# Altium project Topping_L50.PrjPcb
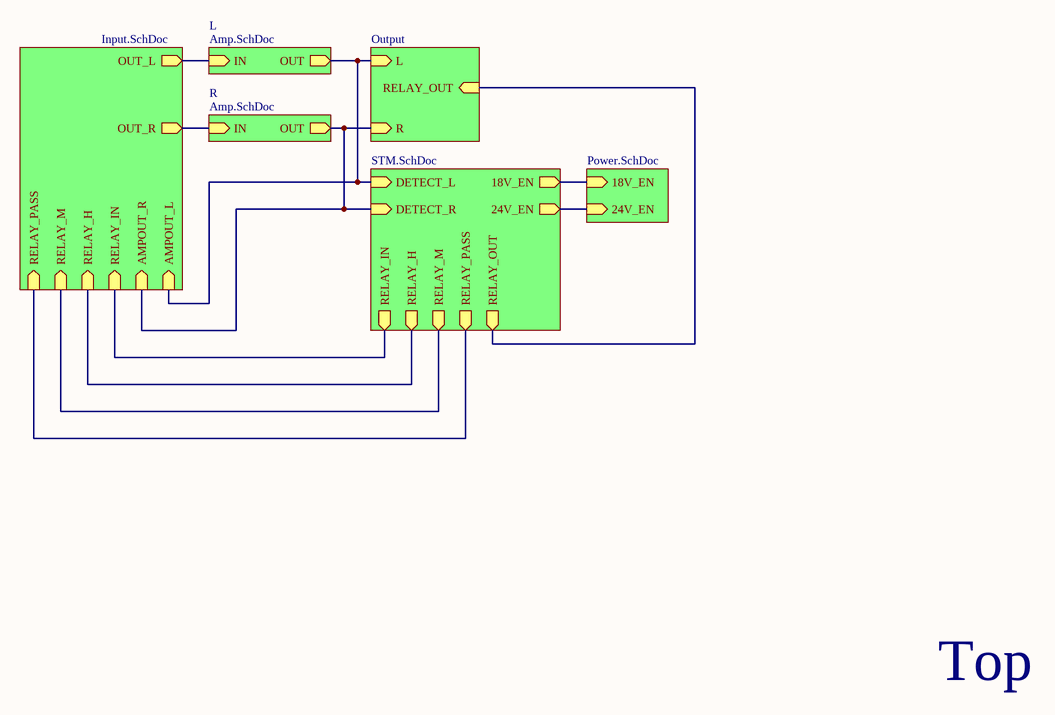
[diagram p0: Top.SchDoc]
6 sheets, 272 parts. Net scope: hierarchical (ports join the sheet entries above them; power ports are global).
Sheets:
  Top.SchDoc
    L = Amp.SchDoc
    R = Amp.SchDoc
    Power = Power.SchDoc
    STM = STM.SchDoc
    In = Input.SchDoc
    Output = Output.SchDoc

## Sheet Top.SchDoc
size A4; SheetNumber: 1; SheetTotal: 6

### Sub-sheets
In = Input.SchDoc: OUT_L (out), OUT_R (out), RELAY_IN (in), RELAY_H (in), RELAY_M (in), AMPOUT_L (in), AMPOUT_R (in), RELAY_PASS (in)
L = Amp.SchDoc: IN (in), OUT (out)
Output = Output.SchDoc: L (in), R (in), RELAY_OUT (in)
Power = Power.SchDoc: 18V_EN (in), 24V_EN (in)
R = Amp.SchDoc: IN (in), OUT (out)
STM = STM.SchDoc: DETECT_L (in), DETECT_R (in), 18V_EN (out), 24V_EN (out), RELAY_IN (out), RELAY_H (out), RELAY_M (out), RELAY_PASS (out), RELAY_OUT (out)

### Nets
NetC51_2: sheet L/OUT, sheet STM/DETECT_L, sheet In/AMPOUT_L, sheet Output/L
NetC63_1: sheet R/OUT, sheet STM/DETECT_R, sheet In/AMPOUT_R, sheet Output/R
NetD22_A: sheet STM/RELAY_H, sheet In/RELAY_H
NetD23_A: sheet STM/RELAY_IN, sheet In/RELAY_IN
NetD24_A: sheet STM/RELAY_M, sheet In/RELAY_M
NetD29_A: sheet STM/RELAY_PASS, sheet In/RELAY_PASS
NetD32_A: sheet STM/RELAY_OUT, sheet Output/RELAY_OUT
NetQ5_E: sheet Power/24V_EN, sheet STM/24V_EN
NetR48_2: sheet Power/18V_EN, sheet STM/18V_EN
NetR68_2: sheet L/IN, sheet In/OUT_L
NetR84_2: sheet R/IN, sheet In/OUT_R

### Notes on the sheet
- Top

## Sheet Amp.SchDoc
size A3; SheetNumber: 2; SheetTotal: 6
Used 2 times, as channels L, R. Parts and nets are listed once, with the designators drawn on the sheet.
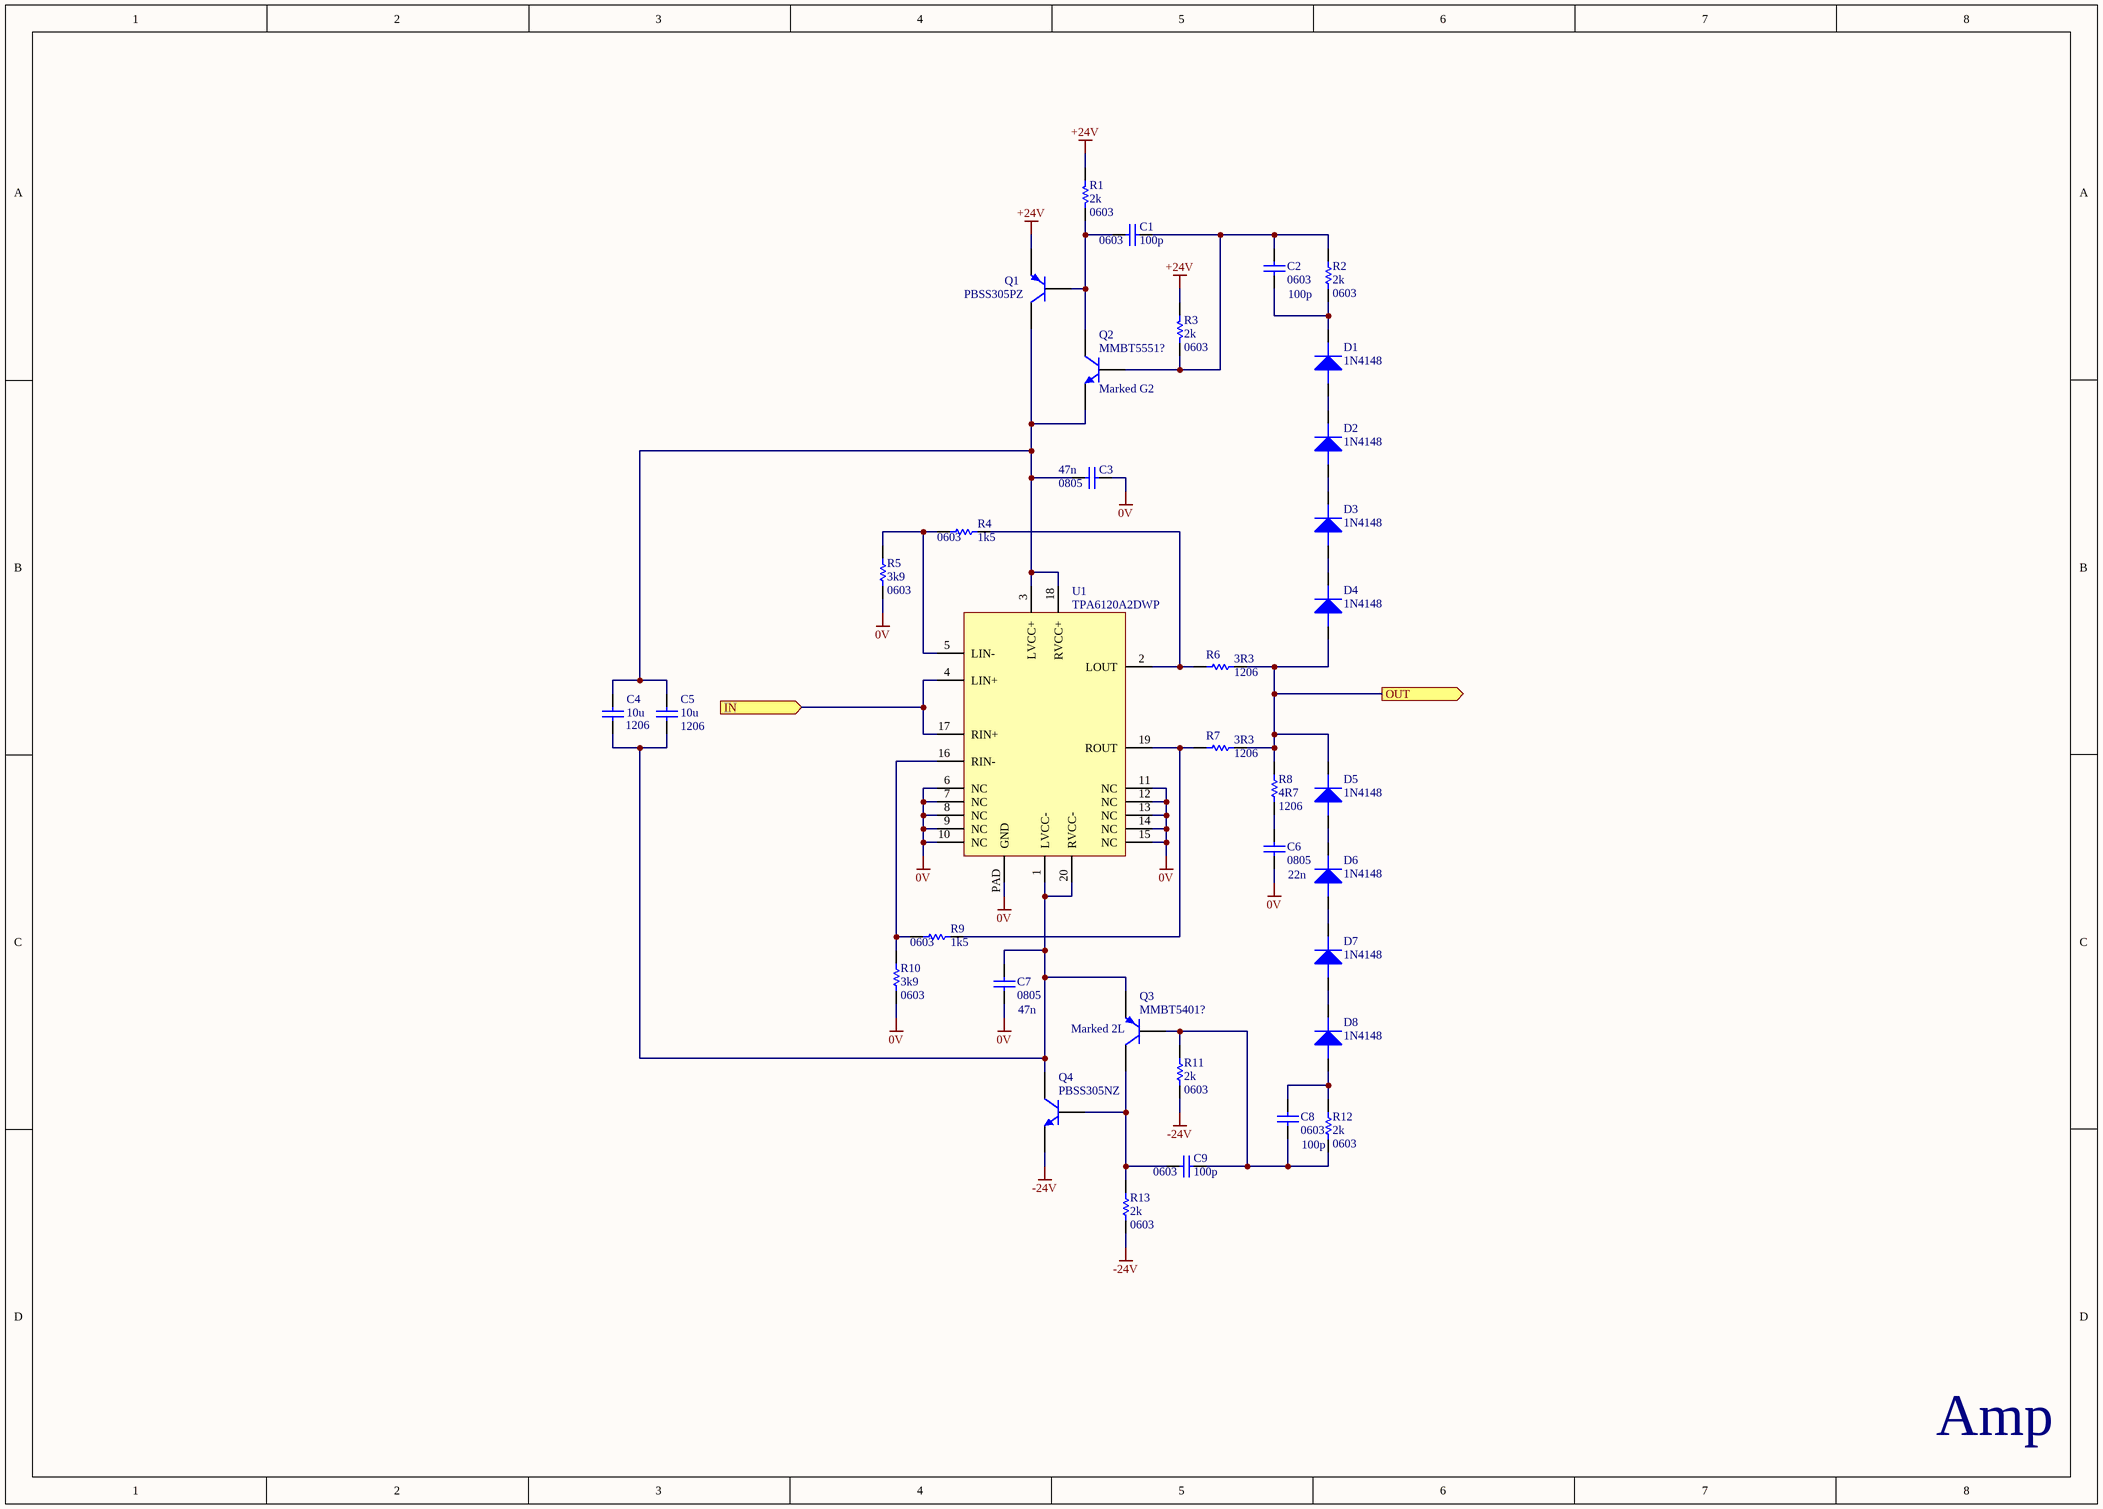
[diagram p1: Amp.SchDoc]

### Parts
C1  value 100p  Package: 0603  [CAPC1608X09N]  (hidden comment: C_MLCC_0603)
C2  value 100p  Package: 0603  [CAPC1608X09N]  (hidden comment: C_MLCC_0603)
C3  value 47n  Package: 0805  [CAPC2012X14N]  (hidden comment: C_MLCC_0805)
C4  value 10u  Package: 1206  [C_NP_1206]  (hidden comment: C_MLCC_1206)
C5  value 10u  Package: 1206  [C_NP_1206]  (hidden comment: C_MLCC_1206)
C6  value 22n  Package: 0805  [CAPC2012X14N]  (hidden comment: C_MLCC_0805)
C7  value 47n  Package: 0805  [CAPC2012X14N]  (hidden comment: C_MLCC_0805)
C8  value 100p  Package: 0603  [CAPC1608X09N]  (hidden comment: C_MLCC_0603)
C9  value 100p  Package: 0603  [CAPC1608X09N]  (hidden comment: C_MLCC_0603)
D1  1N4148
D2  1N4148
D3  1N4148
D4  1N4148
D5  1N4148
D6  1N4148
D7  1N4148
D8  1N4148
Q1  PBSS305PZ  [SOT230P700X165-4N]
Q2  value MMBT5551?  [SOT95P230X110-3N]  (hidden comment: MMBT5551)
Q3  value MMBT5401?  [SOT95P230X110-3N]  (hidden comment: MMBT5401)
Q4  PBSS305NZ  [SOT230P700X165-4N]
R1  value 2k  Package: 0603  [RESC1608X06N]  (hidden comment: R)
R2  value 2k  Package: 0603  [RESC1608X06N]  (hidden comment: R)
R3  value 2k  Package: 0603  [RESC1608X06N]  (hidden comment: R)
R4  value 1k5  Package: 0603  [RESC1608X06N]  (hidden comment: R)
R5  value 3k9  Package: 0603  [RESC1608X06N]  (hidden comment: R)
R6  value 3R3  Package: 1206  [RESC3116X06N]  (hidden comment: R)
R7  value 3R3  Package: 1206  [RESC3116X06N]  (hidden comment: R)
R8  value 4R7  Package: 1206  [RESC3116X06N]  (hidden comment: R)
R9  value 1k5  Package: 0603  [RESC1608X06N]  (hidden comment: R)
R10  value 3k9  Package: 0603  [RESC1608X06N]  (hidden comment: R)
R11  value 2k  Package: 0603  [RESC1608X06N]  (hidden comment: R)
R12  value 2k  Package: 0603  [RESC1608X06N]  (hidden comment: R)
R13  value 2k  Package: 0603  [RESC1608X06N]  (hidden comment: R)
U1  TPA6120A2DWP  [SOIC127P1040X265_HS-21N]

### Ports
IN (in, see Top[2B]), OUT (out, see Top[3B])

### Nets
0V: C3.1 C6.1 C7.1 R5.2 R10.2 U1.6(NC) U1.7(NC) U1.8(NC) U1.9(NC) U1.10(NC) U1.11(NC) U1.12(NC) U1.13(NC) U1.14(NC) U1.15(NC) U1.PAD(GND)
+24V: Q1.E R1.2 R3.2
-24V: Q4.E R11.2 R13.2
IN: U1.4(LIN+) U1.17(RIN+) ; port IN
OUT: D4.A D5.K R6.2 R7.2 R8.2 ; port OUT
NetC1_1: C1.1 Q1.B Q2.C R1.1
NetC1_2: C1.2 C2.1 Q2.B R2.1 R3.1
NetC2_2: C2.2 D1.K R2.2
NetC3_2: C3.2 C4.1 C5.1 Q1.C Q2.E U1.3(LVCC+) U1.18(RVCC+)
NetC4_2: C4.2 C5.2 C7.2 Q3.E Q4.C U1.1(LVCC-) U1.20(RVCC-)
NetC6_2: C6.2 R8.1
NetC8_1: C8.1 D8.A R12.1
NetC8_2: C8.2 C9.2 Q3.B R11.1 R12.2
NetC9_1: C9.1 Q3.C Q4.B R13.1
NetD1_A: D1.A D2.K
NetD2_A: D2.A D3.K
NetD3_A: D3.A D4.K
NetD5_A: D5.A D6.K
NetD6_A: D6.A D7.K
NetD7_A: D7.A D8.K
NetR4_1: R4.1 R6.1 U1.2(LOUT)
NetR4_2: R4.2 R5.1 U1.5(LIN-)
NetR7_1: R7.1 R9.1 U1.19(ROUT)
NetR9_2: R9.2 R10.1 U1.16(RIN-)

### Channels
L: designators end in _L; ports IN=NetR68_2 OUT=NetC51_2
R: designators end in _R; ports IN=NetR84_2 OUT=NetC63_1

### Notes on the sheet
- (near Q2) Marked G2
- (near Q3) Marked 2L
- Amp

### Library data of the parts
C1 C2 C8 C9 = C_MLCC_0603: Generic MLCC 0603 Non Polarized Capacitor; Category: Capacitor; Sub-Category: MLCC; Manufacturer: Generic; Notes: *
C3 C6 C7 = C_MLCC_0805: Generic MLCC 0805 Non Polarized Capacitor; Category: Capacitor; Sub-Category: MLCC; Manufacturer: Generic; Notes: *
C4 C5 = C_MLCC_1206: Generic MLCC Non Polarized Capacitor 1206; Manufacturer: Generic; Category: Capacitor; Sub-Category: MLCC; Notes: *
D1-D8 = 1N4148: Generic small signal diode; Manufacturer Part Number: BAT48ZFILM; Number of Elements: 1; Rep Pk Reverse Voltage-Max: 40V; Package Body Material: Plastic; Diode Type: RECTIFIER; Forward Voltage-Max (VF): 250mV; Non-rep Pk Forward Current-Max: 2A; Diode Element Material: SILICON; Time @ Peak Reflow Temperature-Max (s): 30s; Max Output Current: 350mA; Qualification Status: Not Qualified; Peak Reflow Temperature (Cel): 260°C; Max Operating Temperature: 150°C; Terminal Position: DUAL; Technology: SCHOTTKY; JESD-30 Code: R-PDSO-G2; Category: Diode; Surface Mount: Yes; RoHS Compliant: Yes; Manufacturer: Generic; Number of Pins: 2; Sub-Category: Signal; Terminal Form: Gull Wing; REACH SVHC: Yes; JESD-609 Code: e3; Package Shape: Rectangular; Package Style: SMALL OUTLINEMeter; Terminal Finish: Tin; Component Type: Standard_Diode; Value: 1N4148
Q1 = PBSS305PZ: 80 V, 5.1 A PNP low VCEsat (BISS) transistor; pin to pad: B>1 C>2+TAB E>3; Manufacturer: NXP; Manufacturer Part Number: DZT2222A-13; Collector-emitter Voltage-Max: 40V; Time @ Peak Reflow Temperature-Max (s): 40s; Number of Elements: 1; Case Connection: COLLECTOR; Transistor Application: SWITCHING; Polarity/Channel Type: NPN; Package Body Material: Plastic; Turn-on Time-Max (ton): 35ns; Power Dissipation-Max (Abs): 1W; DC Current Gain-Min (hFE): 40; Max Collector Current: 600mA; Transistor Element Material: SILICON; Transition Frequency-Nom (fT): 300MHz; Qualification Status: Not Qualified; Turn-off Time-Max (toff): 285ns; Max Operating Temperature: 150°C; JESD-609 Code: e3; Moisture Sensitivity Level: 1; Sub-Category: BJT; JESD-30 Code: R-PDSO-G4; RoHS Compliant: Yes; Surface Mount: Yes; REACH SVHC: Yes; Terminal Finish: Tin; Terminal Form: Gull Wing; Package Shape: Rectangular; Number of Pins: 4; Package Style: SMALL OUTLINEMeter; Category: Transistor; Peak Reflow Temperature (Cel): 260°C; Terminal Position: DUAL; Component Type: Standard_Transistor; Package: SOT223-4; Value: PBSS305PZ
Q2 = MMBT5551: NPN General-Purpose / Amplifier; pin to pad: B>1 C>3 E>2; Manufacturer: On Semi; Manufacturer Part Number: MMBT3904VL; Package Body Material: Plastic; JEDEC-95 Code: TO-236AB; Transistor Application: SWITCHING; Max Collector Current: 200mA; DC Current Gain-Min (hFE): 30; Turn-on Time-Max (ton): 70ns; Turn-off Time-Max (toff): 250ns; Transistor Element Material: SILICON; Number of Elements: 1; Transition Frequency-Nom (fT): 300MHz; Collector-emitter Voltage-Max: 40V; Package Shape: Rectangular; JESD-30 Code: R-PDSO-G3; Number of Pins: 3; REACH SVHC: Yes; Sub-Category: BJT; RoHS Compliant: Yes; Terminal Position: DUAL; Surface Mount: Yes; Terminal Form: Gull Wing; Package Style: SMALL OUTLINEMeter; Polarity/Channel Type: NPN; Category: Transistor; Component Type: Standard_Transistor
Q3 = MMBT5401: PNP Epitaxial Silicon Transistor; pin to pad: B>1 C>3 E>2; Manufacturer: On Semi; Manufacturer Part Number: MMBT3904VL; Package Body Material: Plastic; JEDEC-95 Code: TO-236AB; Transistor Application: SWITCHING; Max Collector Current: 200mA; DC Current Gain-Min (hFE): 30; Turn-on Time-Max (ton): 70ns; Turn-off Time-Max (toff): 250ns; Number of Elements: 1; Polarity/Channel Type: NPN; Transition Frequency-Nom (fT): 300MHz; Collector-emitter Voltage-Max: 40V; Package Shape: Rectangular; JESD-30 Code: R-PDSO-G3; Number of Pins: 3; REACH SVHC: Yes; Sub-Category: BJT; RoHS Compliant: Yes; Transistor Element Material: SILICON; Terminal Position: DUAL; Surface Mount: Yes; Terminal Form: Gull Wing; Package Style: SMALL OUTLINEMeter; Category: Transistor; Component Type: Standard_Transistor
Q4 = PBSS305NZ: 80 V, 5.1 A NPN low VCEsat (BISS) transistor; pin to pad: B>1 C>2+TAB E>3; Manufacturer: NXP; Manufacturer Part Number: DZT2222A-13; Collector-emitter Voltage-Max: 40V; Time @ Peak Reflow Temperature-Max (s): 40s; Number of Elements: 1; Case Connection: COLLECTOR; Transistor Application: SWITCHING; Package Body Material: Plastic; Turn-on Time-Max (ton): 35ns; Power Dissipation-Max (Abs): 1W; DC Current Gain-Min (hFE): 40; Max Collector Current: 600mA; Transistor Element Material: SILICON; Transition Frequency-Nom (fT): 300MHz; Qualification Status: Not Qualified; Turn-off Time-Max (toff): 285ns; Max Operating Temperature: 150°C; JESD-609 Code: e3; Moisture Sensitivity Level: 1; Sub-Category: BJT; JESD-30 Code: R-PDSO-G4; RoHS Compliant: Yes; Surface Mount: Yes; REACH SVHC: Yes; Polarity/Channel Type: NPN; Terminal Finish: Tin; Terminal Form: Gull Wing; Package Shape: Rectangular; Number of Pins: 4; Package Style: SMALL OUTLINEMeter; Category: Transistor; Peak Reflow Temperature (Cel): 260°C; Terminal Position: DUAL; Component Type: Standard_Transistor; Package: SOT223-4; Value: PBSS305NZ
R1-R5 R9-R13 = R_0603: Generic 0603 Single Resistor; Manufacturer: Generic; Category: Resistor; Sub-Category: SMD; Notes: *
R6-R8 = R_1206: Generic 1206 Single Resistor; Manufacturer: Generic; Category: Resistor; Sub-Category: SMD; Notes: *
U1 = TPA6120A2DWP: Audio Amplifier, 1.5W, 2 Channel(s), 1 Func, SOIC20; Manufacturer: Texas Instruments; Manufacturer Part Number: TPA6120A2RGYT; Category: IC; JESD-609 Code: e4; Sub-Category: Audio; Moisture Sensitivity Level: 2; Terminal Finish: Nickel; REACH SVHC: Yes; Consumer IC Type: AUDIO AMPLIFIER; RoHS Compliant: Yes; Peak Reflow Temperature (Cel): 260°C; Component Type: Standard_IC_OpAmp; Package: SOIC20; Value: TPA6120A2DWP

## Sheet Power.SchDoc
size A3; SheetNumber: 3; SheetTotal: 6
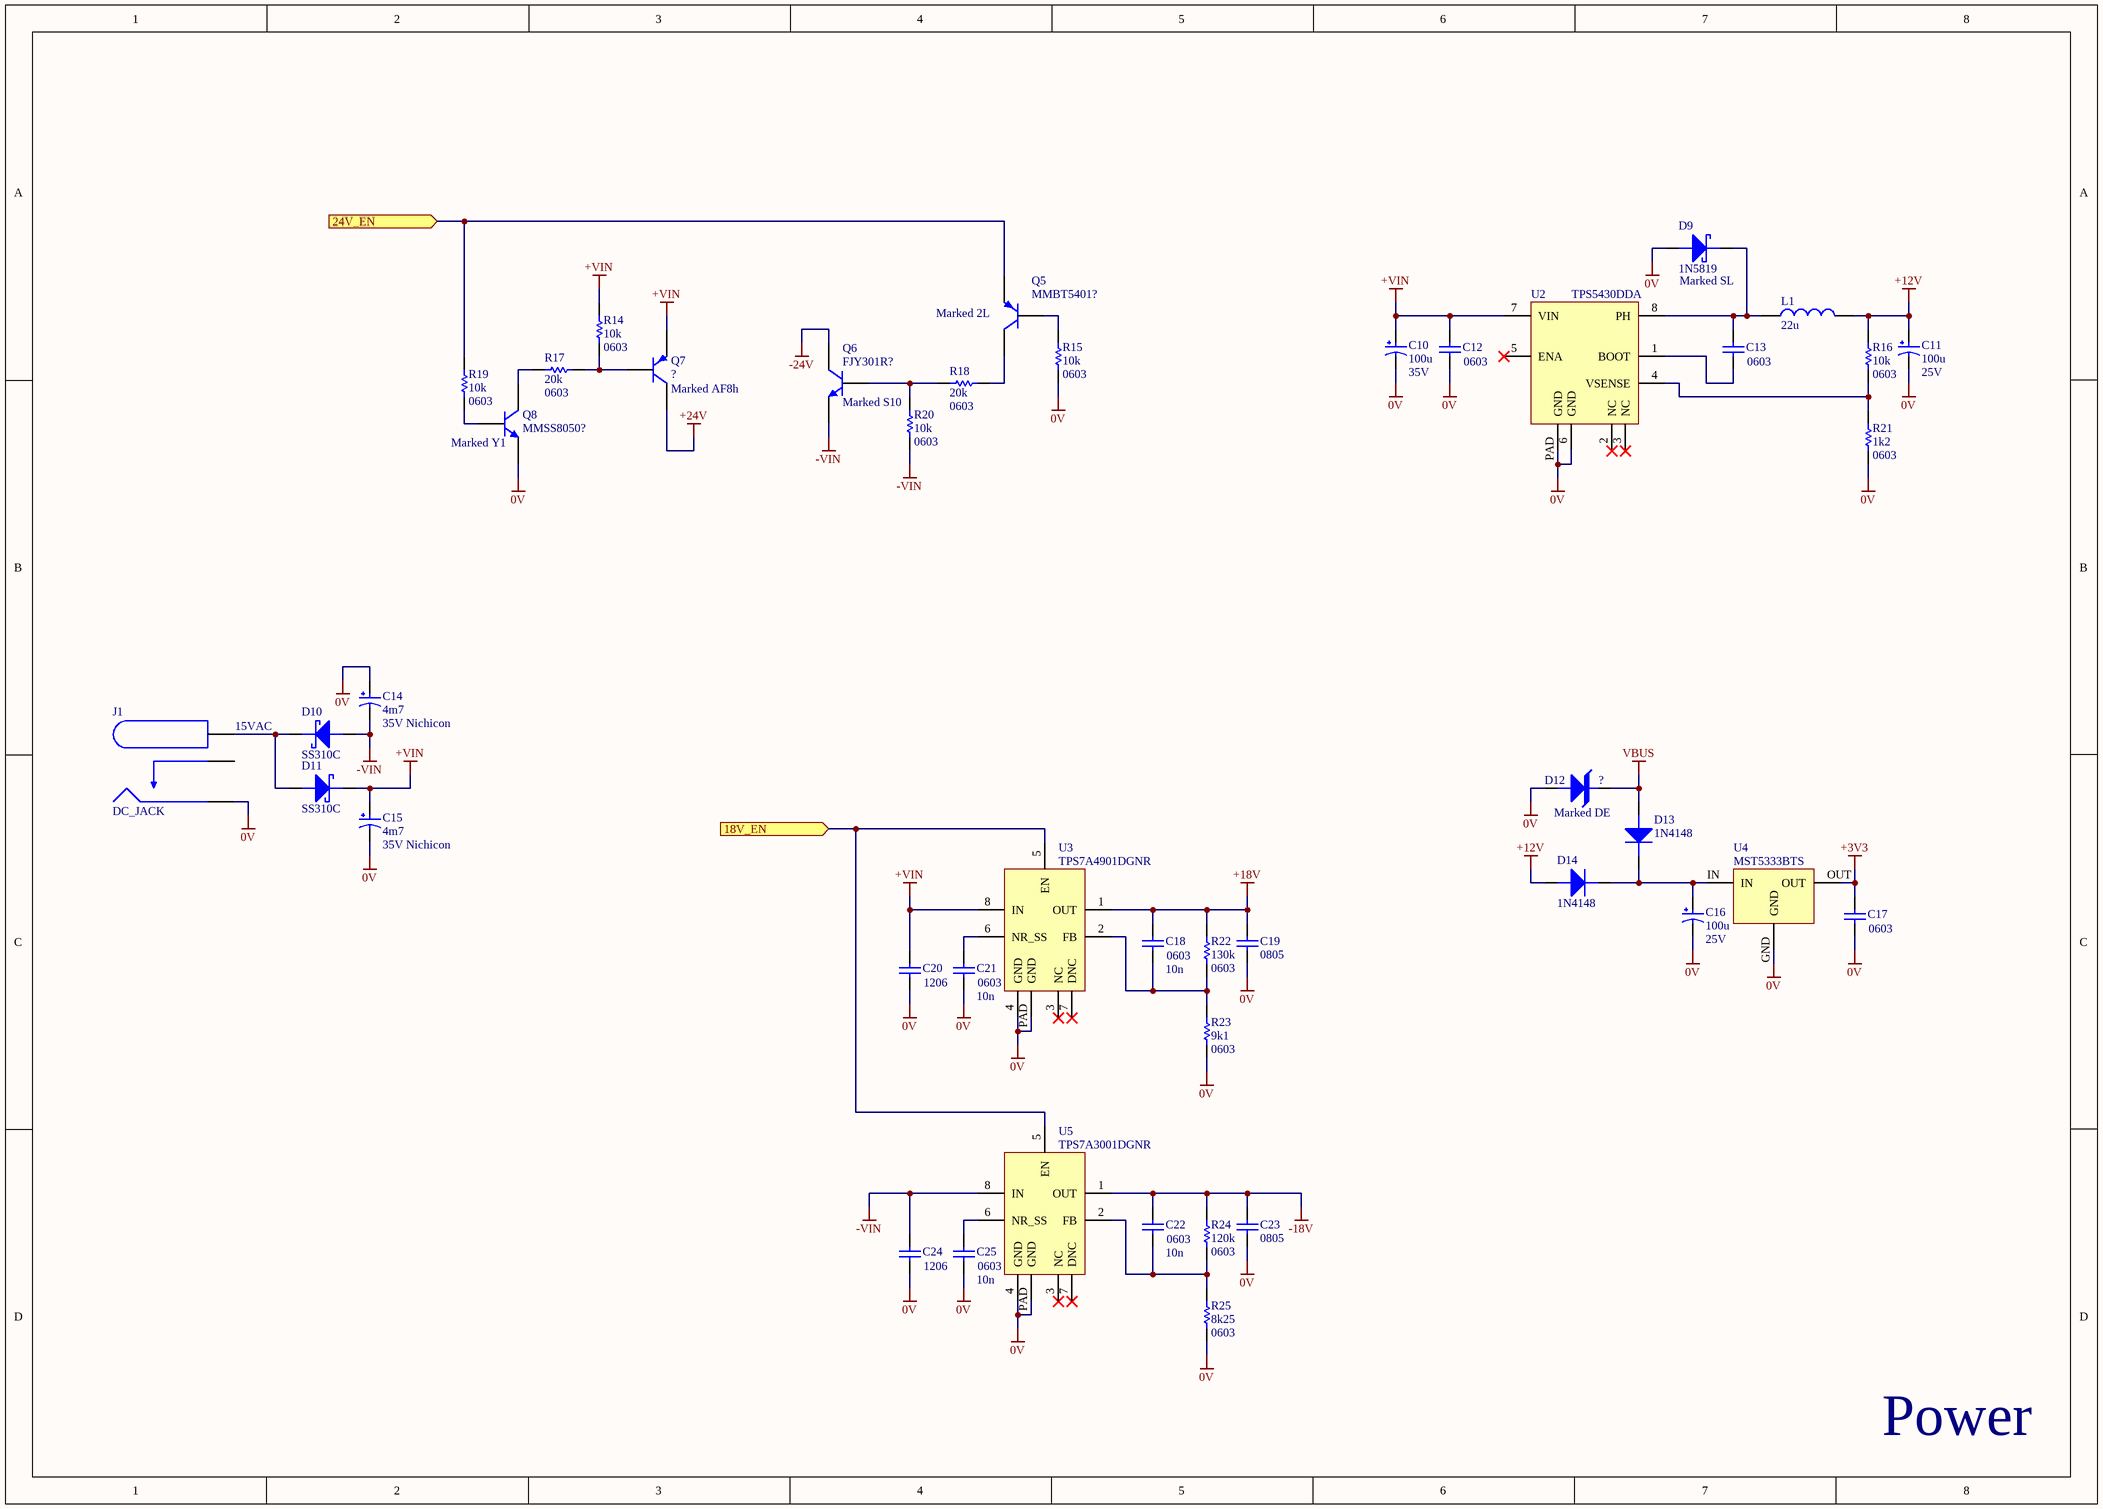
[diagram p2: Power.SchDoc]

### Parts
C10  value 100u  Notes: 35V  [CAPAE13X20]  (hidden comment: 860160378038)
C11  value 100u  Notes: 25V  [CAPAE13X20]  (hidden comment: 860160378038)
C12  Package: 0603  [CAPC1608X09N]  (hidden comment: C_MLCC_0603)
C13  Package: 0603  [CAPC1608X09N]  (hidden comment: C_MLCC_0603)
C14  value 4m7  Notes: 35V Nichicon  [CAPAE13X20]  (hidden comment: 860160378038)
C15  value 4m7  Notes: 35V Nichicon  [CAPAE13X20]  (hidden comment: 860160378038)
C16  value 100u  Notes: 25V  [CAPAE13X20]  (hidden comment: 860160378038)
C17  Package: 0603  [CAPC1608X09N]  (hidden comment: C_MLCC_0603)
C18  value 10n  Package: 0603  [CAPC1608X09N]  (hidden comment: C_MLCC_0603)
C19  Package: 0805  [CAPC2012X14N]  (hidden comment: C_MLCC_0805)
C20  Package: 1206  [C_NP_1206]  (hidden comment: C_MLCC_1206)
C21  value 10n  Package: 0603  [CAPC1608X09N]  (hidden comment: C_MLCC_0603)
C22  value 10n  Package: 0603  [CAPC1608X09N]  (hidden comment: C_MLCC_0603)
C23  Package: 0805  [CAPC2012X14N]  (hidden comment: C_MLCC_0805)
C24  Package: 1206  [C_NP_1206]  (hidden comment: C_MLCC_1206)
C25  value 10n  Package: 0603  [CAPC1608X09N]  (hidden comment: C_MLCC_0603)
D9  1N5819
D10  SS310C  [DIOM6959X26N]
D11  SS310C  [DIOM6959X26N]
D12  TVS  [DIOM4336X24N]  (value not drawn)
D13  1N4148
D14  1N4148
J1  DC_JACK  [DC_JACK]
L1  value 22u  (hidden comment: L)
Q5  value MMBT5401?  [SOT95P230X110-3N]  (hidden comment: MMBT5401)
Q6  value FJY301R?  [SOT95P230X110-3N]  (hidden comment: MMBT5551)
Q7  MMBT5401  [SOT95P230X110-3N]  (value not drawn)
Q8  value MMSS8050?  [SOT95P230X110-3N]  (hidden comment: MMBT5551)
R14  value 10k  Package: 0603  [RESC1608X06N]  (hidden comment: R)
R15  value 10k  Package: 0603  [RESC1608X06N]  (hidden comment: R)
R16  value 10k  Package: 0603  [RESC1608X06N]  (hidden comment: R)
R17  value 20k  Package: 0603  [RESC1608X06N]  (hidden comment: R)
R18  value 20k  Package: 0603  [RESC1608X06N]  (hidden comment: R)
R19  value 10k  Package: 0603  [RESC1608X06N]  (hidden comment: R)
R20  value 10k  Package: 0603  [RESC1608X06N]  (hidden comment: R)
R21  value 1k2  Package: 0603  [RESC1608X06N]  (hidden comment: R)
R22  value 130k  Package: 0603  [RESC1608X06N]  (hidden comment: R)
R23  value 9k1  Package: 0603  [RESC1608X06N]  (hidden comment: R)
R24  value 120k  Package: 0603  [RESC1608X06N]  (hidden comment: R)
R25  value 8k25  Package: 0603  [RESC1608X06N]  (hidden comment: R)
U2  TPS5430DDA  [SOIC127P600X170_HS-9N]
U3  TPS7A4901DGNR  [TSOP65P490X110_HS-9N]
U4  MST5333BTS  [SOT89-150P410X160-3N]
U5  TPS7A3001DGNR  [TSOP65P490X110_HS-9N]

### Ports
18V_EN (in, see Top[3B], STM[3B]), 24V_EN (in, see Top[3B], STM[5B])

### Nets
0V: C10.- C11.- C12.1 C14.+ C15.- C16.- C17.1 C19.1 C20.1 C21.1 C23.1 C24.1 C25.1 D9.A D12.A J1.S Q8.E R15.1 R21.1 R23.1 R25.1 U2.6(GND) U2.PAD(GND) U3.4(GND) U3.PAD(GND) U4.GND U5.4(GND) U5.PAD(GND)
+3V3: C17.2 U4.OUT
+12V: C11.+ D14.A L1.2 R16.2
+18V: C18.2 C19.2 R22.2 U3.1(OUT)
+24V: Q7.C
+VIN: C10.+ C12.2 C15.+ C20.2 D11.K Q7.E R14.1 U2.7(VIN) U3.8(IN)
-18V: C22.2 C23.2 R24.2 U5.1(OUT)
-24V: Q6.C
-VIN: C14.- C24.2 D10.A Q6.E R20.2 U5.8(IN)
VBUS: D12.K D13.A
NetC13_1: C13.1 U2.1(BOOT)
NetC13_2: C13.2 D9.K L1.1 U2.8(PH)
NetC16_+: C16.+ D13.K D14.K U4.IN
NetC18_1: C18.1 R22.1 R23.2 U3.2(FB)
NetC21_2: C21.2 U3.6(NR_SS)
NetC22_1: C22.1 R24.1 R25.2 U5.2(FB)
NetC25_2: C25.2 U5.6(NR_SS)
NetD10_K: D10.K D11.A J1.T
NetQ5_B: Q5.B R15.2
NetQ5_C: Q5.C R18.1
NetQ5_E: Q5.E R19.1 ; port 24V_EN
NetQ6_B: Q6.B R18.2 R20.1
NetQ7_B: Q7.B R14.2 R17.1
NetQ8_B: Q8.B R19.2
NetQ8_C: Q8.C R17.2
NetR16_1: R16.1 R21.2 U2.4(VSENSE)
NetR48_2: U3.5(EN) U5.5(EN) ; port 18V_EN

Not connected (* = marked no-connect by the designer): J1 SN; U2 2(NC)* 3(NC)* 5(ENA)*; U3 3(NC)* 7(DNC)*; U5 3(NC)* 7(DNC)*

### Notes on the sheet
- (near Q5) Marked 2L
- (near D9) Marked SL
- (near Q8) Marked Y1
- (near Q7) Marked AF8h
- (near Q6) Marked S10
- 15VAC
- Marked DE
- Power

### Library data of the parts
C10 C11 C14-C16 = 860160378038: Alum. Electrolytic Cap 2200µF 16V 13mm Radial WCAP-ATLL; Lifetime 7000h +105°C; Manufacturer: Würth Elektronik; Impedance: 90mR; Ripple Current: 2.082A; Polarity: Polar; Life (Hours): 7000Hour; Tolerance: 20%; Capacitance: 2.2mF; Height - Seated (Max): 0.846inch; RoHS Compliant: Yes; Max Operating Temperature: 105°C; Sub-Category: Electrolytic; Mount: Through Hole; Min Operating Temperature: -55°C; Packaging: Tape and Reel; Category: Capacitor; Package Quantity: 300; Voltage Rating: 16V; Lead Pitch: 0.197inch; Case/Package: Radial; Manufacturer Part Number: 860160378038; Component Type: Standard_Passive_C
C12 C13 C17 C18 C21 C22 C25 = C_MLCC_0603: as C1 on sheet Amp; Category: Capacitor; Sub-Category: MLCC; Manufacturer: Generic; Notes: *
  C12 C13 C17: Value: *
C19 C23 = C_MLCC_0805: as C3 on sheet Amp; Category: Capacitor; Sub-Category: MLCC; Manufacturer: Generic; Notes: *; Value: *
C20 C24 = C_MLCC_1206: as C4 on sheet Amp; Manufacturer: Generic; Category: Capacitor; Sub-Category: MLCC; Notes: *; Value: *
D9 = 1N5819: Generic Schottky, 1N5819; Manufacturer Part Number: SS3H10-E3/9AT; Diode Element Material: SILICON; Forward Voltage-Max (VF): 650mV; Time @ Peak Reflow Temperature-Max (s): 40s; Diode Type: RECTIFIER; Number of Phases: 1; Non-rep Pk Forward Current-Max: 100A; Rep Pk Reverse Voltage-Max: 100V; Application(s): EFFICIENCY; Qualification Status: Not Qualified; JEDEC-95 Code: DO-214AB; Max Output Current: 3A; Package Body Material: Plastic; Terminal Position: DUAL; JESD-609 Code: e3; JESD-30 Code: R-PDSO-C2; Technology: SCHOTTKY; Min Operating Temperature: -65°C; Terminal Finish: Tin; Package Shape: Rectangular; RoHS Compliant: Yes; Manufacturer: Generic; REACH SVHC: No SVHC; Moisture Sensitivity Level: 1; Number of Elements: 1; Category: Diode; Peak Reflow Temperature (Cel): 260°C; Terminal Form: C BEND; Max Operating Temperature: 175°C; Number of Pins: 2; Package Style: SMALL OUTLINEMeter; Sub-Category: Power; Surface Mount: Yes; Component Type: Standard_Diode; Value: 1N5819
D10 D11 = SS310C: Rectifier Diode, Schottky, 1 Phase, 1 Element, 3A, 100V V(RRM), Silicon, DO-214AB; Manufacturer: Generic; Manufacturer Part Number: SS3H10-E3/9AT; Forward Voltage-Max (VF): 650mV; Time @ Peak Reflow Temperature-Max (s): 40s; Number of Phases: 1; Non-rep Pk Forward Current-Max: 100A; Application(s): EFFICIENCY; Qualification Status: Not Qualified; Package Body Material: Plastic; Terminal Position: DUAL; Diode Element Material: SILICON; JESD-609 Code: e3; JESD-30 Code: R-PDSO-C2; Technology: SCHOTTKY; Diode Type: RECTIFIER; Min Operating Temperature: -65°C; Terminal Finish: Tin; Package Shape: Rectangular; RoHS Compliant: Yes; Rep Pk Reverse Voltage-Max: 100V; REACH SVHC: No SVHC; Moisture Sensitivity Level: 1; Number of Elements: 1; Category: Diode; Peak Reflow Temperature (Cel): 260°C; Terminal Form: C BEND; JEDEC-95 Code: DO-214AB; Max Operating Temperature: 175°C; Max Output Current: 3A; Number of Pins: 2; Package Style: SMALL OUTLINEMeter; Sub-Category: Power; Surface Mount: Yes; Component Type: Standard_Diode; Package: SMC; Value: SS310C
D12 = TVS: Generic TVS diode; Manufacturer: Bourns; Manufacturer Part Number: SMBJ30A; Breakdown Voltage-Nom: 35.8V; JEDEC-95 Code: DO-214AA; Diode Element Material: SILICON; Min Breakdown Voltage: 33.3V; Max Power Dissipation: 5W; Rep Pk Reverse Voltage-Max: 30V; Number of Elements: 1; Reference Standard: IEC-61000-4-2; Diode Type: TRANS VOLTAGE SUPPRESSOR; Max Breakdown Voltage: 36.8V; Non-rep Peak Rev Power Dis-Max: 600W; Package Body Material: Plastic; Polarity: Unidirectional; Qualification Status: Not Qualified; Min Operating Temperature: -55°C; REACH SVHC: No SVHC; Terminal Finish: Tin; Moisture Sensitivity Level: 1; Number of Pins: 2; JESD-30 Code: R-PDSO-C2; Technology: AVALANCHE; Terminal Position: DUAL; Max Operating Temperature: 150°C; Package Style: SMALL OUTLINEMeter; Package Shape: Rectangular; Terminal Form: C BEND; RoHS Compliant: Yes; Surface Mount: Yes; JESD-609 Code: e3; Sub-Category: TVS; Category: Diode; Component Type: Standard_Diode; Value: ?
D13 D14 = 1N4148: as D1 on sheet Amp; Peak Reflow Temperature (Cel): 260°C; Max Operating Temperature: 150°C; Terminal Position: DUAL; Technology: SCHOTTKY; JESD-30 Code: R-PDSO-G2; Category: Diode; Surface Mount: Yes; RoHS Compliant: Yes; Manufacturer: Generic; Number of Pins: 2; Sub-Category: Signal; Terminal Form: Gull Wing; REACH SVHC: Yes; JESD-609 Code: e3; Package Shape: Rectangular; Package Style: SMALL OUTLINEMeter; Terminal Finish: Tin; Component Type: Standard_Diode; Value: 1N4148
J1 = DC_JACK: Generic Switched Horizontal DC Jack; Manufacturer: Generic; Category: Connector; Sub-Category: Jack; Value: DC_JACK
L1 = L: Generic L; Manufacturer Part Number: MPXV1D1054L150; RoHS Compliant: Yes; Sub-Category: Power; Manufacturer: Generic; Category: Inductor; Component Type: Standard_Passive_L
Q5 Q7 = MMBT5401: PNP Epitaxial Silicon Transistor; pin to pad: B>1 C>3 E>2; Manufacturer: MCC; Manufacturer Part Number: MMBT3904VL; Package Body Material: Plastic; JEDEC-95 Code: TO-236AB; Transistor Application: SWITCHING; Max Collector Current: 200mA; DC Current Gain-Min (hFE): 30; Turn-on Time-Max (ton): 70ns; Turn-off Time-Max (toff): 250ns; Number of Elements: 1; Polarity/Channel Type: NPN; Transition Frequency-Nom (fT): 300MHz; Collector-emitter Voltage-Max: 40V; Package Shape: Rectangular; JESD-30 Code: R-PDSO-G3; Number of Pins: 3; REACH SVHC: Yes; Sub-Category: BJT; RoHS Compliant: Yes; Transistor Element Material: SILICON; Terminal Position: DUAL; Surface Mount: Yes; Terminal Form: Gull Wing; Package Style: SMALL OUTLINEMeter; Category: Transistor; Component Type: Standard_Transistor
  Q7: Value: ?
Q6 Q8 = MMBT5551: NPN General-Purpose / Amplifier; pin to pad: B>1 C>3 E>2; Manufacturer: On Semi; Manufacturer Part Number: MMBT3904VL; Package Body Material: Plastic; JEDEC-95 Code: TO-236AB; Transistor Application: SWITCHING; Max Collector Current: 200mA; DC Current Gain-Min (hFE): 30; Turn-on Time-Max (ton): 70ns; Turn-off Time-Max (toff): 250ns; Transistor Element Material: SILICON; Number of Elements: 1; Transition Frequency-Nom (fT): 300MHz; Collector-emitter Voltage-Max: 40V; Package Shape: Rectangular; JESD-30 Code: R-PDSO-G3; Number of Pins: 3; REACH SVHC: Yes; Sub-Category: BJT; RoHS Compliant: Yes; Terminal Position: DUAL; Surface Mount: Yes; Terminal Form: Gull Wing; Package Style: SMALL OUTLINEMeter; Polarity/Channel Type: NPN; Category: Transistor; Component Type: Standard_Transistor
R14-R25 = R_0603: Generic 0603 Single Resistor; Manufacturer: Generic; Category: Resistor; Sub-Category: SMD; Notes: *
U2 = TPS5430DDA: Wide Input Range, Step-Down Converter; Manufacturer: Texas Instruments; Category: IC; Sub-Category: Power; Value: TPS5430DDA
U3 = TPS7A4901DGNR: –35-V, –200-mA, Ultralow-Noise, Positive Linear Regulator; Manufacturer: Texas Instruments; Package: HVSSOP8; Category: IC; Sub-Category: Power; Value: TPS7A4901DGNR
U4 = MST5333BTS: Fixed Positive Standard Regulator, 3.3VBIPolar, PSSO3; pin to pad: GND>2 IN>3 OUT>1; Manufacturer: Milestone Semiconductor Inc.; Manufacturer Part Number: L78L33ACUTR; Output Voltage1-Nom: 3.3V; Load Regulation-Max: 0.06%; Qualification Status: Not Qualified; Package Body Material: Plastic; Output Voltage1-Max: 3.465V; Number of Functions: 1; Regulator Type: FIXED POSITIVE SINGLE OUTPUT STANDARD REGULATOR; Output Voltage1-Min: 3.135V; Output Current1-Max: 70mA; Line Regulation-Max: 0.15%; Time @ Peak Reflow Temperature-Max (s): 30s; Max Input Voltage: 20V; Input Voltage Absolute-Max: 30V; Voltage Tolerance-Max: 5%; Dropout Voltage1-Nom: 1.7V; Min Input Voltage: 5.3V; Package Equivalence Code: TO-243; Operating Temperature, TJ-Min: 0°C; REACH SVHC: No SVHC; Terminal Form: Flat; Terminal Position: SINGLE; Packaging: Tape and Reel; Height - Seated (Max): 1.6mm; Operating Temperature, TJ-Max: 125°C; RoHS Compliant: Yes; Technology: BIPOLAR; Adjustability: FIXED; Number of Outputs: 1; Width: 2.445mm; Terminal Finish: Tin; Length: 4.5mm; Moisture Sensitivity Level: 1; Terminal Pitch: 1.495mm; JESD-30 Code: R-PSSO-F3; Number of Pins: 3; Peak Reflow Temperature (Cel): 260°C; Package Style: SMALL OUTLINEMeter; JESD-609 Code: e3; Package Shape: Rectangular; Surface Mount: Yes; Component Type: Standard_IC_Power; Category: IC; Sub-Category: Power; Package: SOT89; Value: MST5333BTS
U5 = TPS7A3001DGNR: –35-V, –200-mA, Ultralow-Noise, Negative Linear Regulator; Manufacturer: Texas Instruments; Package: HVSSOP8; Category: IC; Sub-Category: Power; Value: TPS7A3001DGNR

## Sheet STM.SchDoc
size A3; SheetNumber: 4; SheetTotal: 6
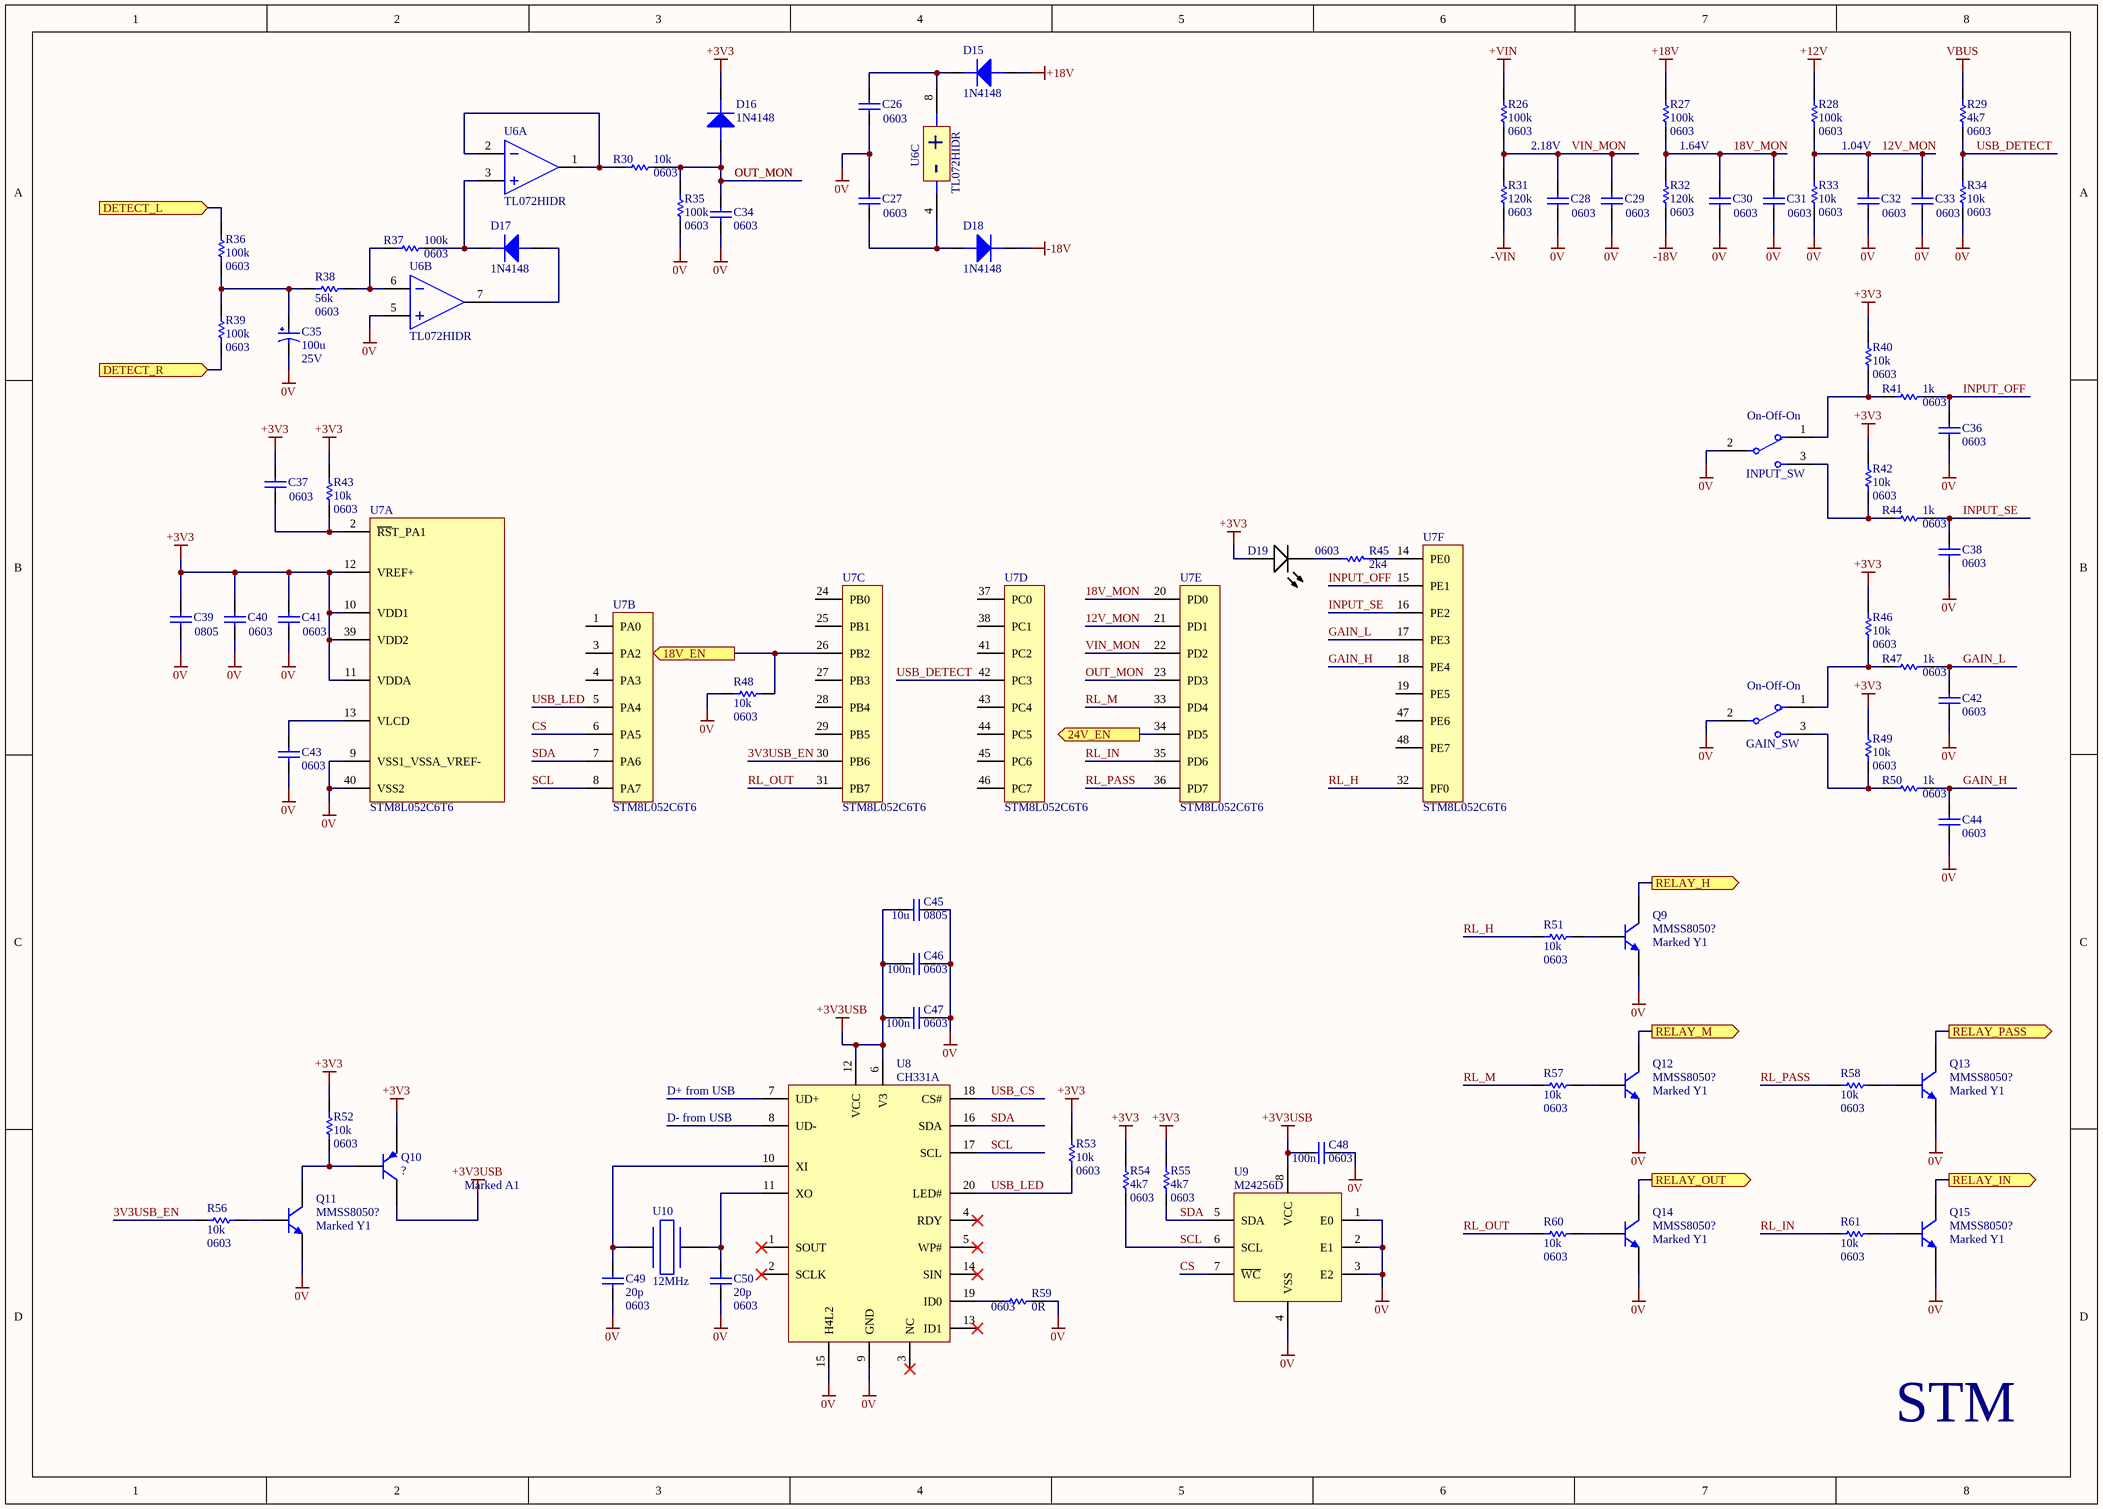
[diagram p3: STM.SchDoc]

### Parts
C26  Package: 0603  [CAPC1608X09N]  (hidden comment: C_MLCC_0603)
C27  Package: 0603  [CAPC1608X09N]  (hidden comment: C_MLCC_0603)
C28  Package: 0603  [CAPC1608X09N]  (hidden comment: C_MLCC_0603)
C29  Package: 0603  [CAPC1608X09N]  (hidden comment: C_MLCC_0603)
C30  Package: 0603  [CAPC1608X09N]  (hidden comment: C_MLCC_0603)
C31  Package: 0603  [CAPC1608X09N]  (hidden comment: C_MLCC_0603)
C32  Package: 0603  [CAPC1608X09N]  (hidden comment: C_MLCC_0603)
C33  Package: 0603  [CAPC1608X09N]  (hidden comment: C_MLCC_0603)
C34  Package: 0603  [CAPC1608X09N]  (hidden comment: C_MLCC_0603)
C35  value 100u  Notes: 25V  [CAPAE13X20]  (hidden comment: 860160378038)
C36  Package: 0603  [CAPC1608X09N]  (hidden comment: C_MLCC_0603)
C37  Package: 0603  [CAPC1608X09N]  (hidden comment: C_MLCC_0603)
C38  Package: 0603  [CAPC1608X09N]  (hidden comment: C_MLCC_0603)
C39  Package: 0805  [CAPC2012X14N]  (hidden comment: C_MLCC_0805)
C40  Package: 0603  [CAPC1608X09N]  (hidden comment: C_MLCC_0603)
C41  Package: 0603  [CAPC1608X09N]  (hidden comment: C_MLCC_0603)
C42  Package: 0603  [CAPC1608X09N]  (hidden comment: C_MLCC_0603)
C43  Package: 0603  [CAPC1608X09N]  (hidden comment: C_MLCC_0603)
C44  Package: 0603  [CAPC1608X09N]  (hidden comment: C_MLCC_0603)
C45  value 10u  Package: 0805  [CAPC2012X14N]  (hidden comment: C_MLCC_0805)
C46  value 100n  Package: 0603  [CAPC1608X09N]  (hidden comment: C_MLCC_0603)
C47  value 100n  Package: 0603  [CAPC1608X09N]  (hidden comment: C_MLCC_0603)
C48  value 100n  Package: 0603  [CAPC1608X09N]  (hidden comment: C_MLCC_0603)
C49  value 20p  Package: 0603  [CAPC1608X09N]  (hidden comment: C_MLCC_0603)
C50  value 20p  Package: 0603  [CAPC1608X09N]  (hidden comment: C_MLCC_0603)
D15  1N4148
D16  1N4148
D17  1N4148
D18  1N4148
D19  LED_TH_3mm_RED  (value not drawn)
GAIN_SW  value On-Off-On  (hidden comment: 1MS1T2B1M2QES)
INPUT_SW  value On-Off-On  (hidden comment: 1MS1T2B1M2QES)
Q9  value MMSS8050?  [SOT95P230X110-3N]  (hidden comment: MMBT5551)
Q10  (no value)  [SOT95P230X110-3N]
Q11  value MMSS8050?  [SOT95P230X110-3N]  (hidden comment: MMBT5551)
Q12  value MMSS8050?  [SOT95P230X110-3N]  (hidden comment: MMBT5551)
Q13  value MMSS8050?  [SOT95P230X110-3N]  (hidden comment: MMBT5551)
Q14  value MMSS8050?  [SOT95P230X110-3N]  (hidden comment: MMBT5551)
Q15  value MMSS8050?  [SOT95P230X110-3N]  (hidden comment: MMBT5551)
R26  value 100k  Package: 0603  [RESC1608X06N]  (hidden comment: R)
R27  value 100k  Package: 0603  [RESC1608X06N]  (hidden comment: R)
R28  value 100k  Package: 0603  [RESC1608X06N]  (hidden comment: R)
R29  value 4k7  Package: 0603  [RESC1608X06N]  (hidden comment: R)
R30  value 10k  Package: 0603  [RESC1608X06N]  (hidden comment: R)
R31  value 120k  Package: 0603  [RESC1608X06N]  (hidden comment: R)
R32  value 120k  Package: 0603  [RESC1608X06N]  (hidden comment: R)
R33  value 10k  Package: 0603  [RESC1608X06N]  (hidden comment: R)
R34  value 10k  Package: 0603  [RESC1608X06N]  (hidden comment: R)
R35  value 100k  Package: 0603  [RESC1608X06N]  (hidden comment: R)
R36  value 100k  Package: 0603  [RESC1608X06N]  (hidden comment: R)
R37  value 100k  Package: 0603  [RESC1608X06N]  (hidden comment: R)
R38  value 56k  Package: 0603  [RESC1608X06N]  (hidden comment: R)
R39  value 100k  Package: 0603  [RESC1608X06N]  (hidden comment: R)
R40  value 10k  Package: 0603  [RESC1608X06N]  (hidden comment: R)
R41  value 1k  Package: 0603  [RESC1608X06N]  (hidden comment: R)
R42  value 10k  Package: 0603  [RESC1608X06N]  (hidden comment: R)
R43  value 10k  Package: 0603  [RESC1608X06N]  (hidden comment: R)
R44  value 1k  Package: 0603  [RESC1608X06N]  (hidden comment: R)
R45  value 2k4  Package: 0603  [RESC1608X06N]  (hidden comment: R)
R46  value 10k  Package: 0603  [RESC1608X06N]  (hidden comment: R)
R47  value 1k  Package: 0603  [RESC1608X06N]  (hidden comment: R)
R48  value 10k  Package: 0603  [RESC1608X06N]  (hidden comment: R)
R49  value 10k  Package: 0603  [RESC1608X06N]  (hidden comment: R)
R50  value 1k  Package: 0603  [RESC1608X06N]  (hidden comment: R)
R51  value 10k  Package: 0603  [RESC1608X06N]  (hidden comment: R)
R52  value 10k  Package: 0603  [RESC1608X06N]  (hidden comment: R)
R53  value 10k  Package: 0603  [RESC1608X06N]  (hidden comment: R)
R54  value 4k7  Package: 0603  [RESC1608X06N]  (hidden comment: R)
R55  value 4k7  Package: 0603  [RESC1608X06N]  (hidden comment: R)
R56  value 10k  Package: 0603  [RESC1608X06N]  (hidden comment: R)
R57  value 10k  Package: 0603  [RESC1608X06N]  (hidden comment: R)
R58  value 10k  Package: 0603  [RESC1608X06N]  (hidden comment: R)
R59  value 0R  Package: 0603  [RESC1608X06N]  (hidden comment: R)
R60  value 10k  Package: 0603  [RESC1608X06N]  (hidden comment: R)
R61  value 10k  Package: 0603  [RESC1608X06N]  (hidden comment: R)
U6  TL072HIDR  [SOIC127P600X175-8L]  (parts A,B,C of 3)
U7  STM8L052C6T6  [CQFP50P900X900X160-48N]  (parts A,B,C,D,E,F of 6)
U8  CH331A  [TSOP65P640X120-20N]
U9  M24256D  [SOIC127P600X175-8L]
U10  12MHz

### Ports
18V_EN (out, see Top[3B], Power[3C]), 24V_EN (out, see Top[3B], Power[2A]), DETECT_L (in, see Top[3B]), DETECT_R (in, see Top[3B]), RELAY_H (out, see Top[3C], Input[6B]), RELAY_IN (out, see Top[3C], Input[5C]), RELAY_M (out, see Top[3C], Input[6C]), RELAY_OUT (out, see Top[3C], Output[2C]), RELAY_PASS (out, see Top[3C], Input[2C])

### Nets
0V: C26.1 C27.2 C28.1 C29.1 C30.1 C31.1 C32.1 C33.1 C34.1 C35.- C36.1 C38.1 C39.1 C40.2 C41.2 C42.1 C43.1 C44.1 C45.1 C46.1 C47.1 C48.1 C49.2 C50.2 GAIN_SW.2 INPUT_SW.2 Q9.E Q11.E Q12.E Q13.E Q14.E Q15.E R33.1 R34.1 R35.1 R48.1 R59.1 U6.5(IN2+) U7.9(VSS1_VSSA_VREF-) U7.40(VSS2) U8.9(GND) U8.15(H4L2) U9.1(E0) U9.2(E1) U9.3(E2) U9.4(VSS)
+3V3: C37.1 C39.2 C40.1 C41.1 D16.K D19.A Q10.E R40.1 R42.2 R43.2 R46.1 R49.2 R52.2 R53.2 R54.2 R55.2 U7.10(VDD1) U7.11(VDDA) U7.12(VREF+) U7.39(VDD2)
+3V3USB: C45.2 C46.2 C47.2 C48.2 Q10.C U8.6(V3) U8.12(VCC) U9.8(VCC)
+12V: R28.2
+18V: D15.A R27.2
+VIN: R26.2
-18V: D18.K R32.1
-VIN: R31.1
VBUS: R29.2
3V3USB_EN: R56.1 U7.30(PB6)
12V_MON: C32.2 C33.2 R28.1 R33.2 U7.21(PD1)
18V_MON: C30.2 C31.2 R27.1 R32.2 U7.20(PD0)
CS: U7.6(PA5) U9.7(~{WC})
GAIN_H: C44.2 R50.2 U7.18(PE4)
GAIN_L: C42.2 R47.2 U7.17(PE3)
INPUT_OFF: C36.2 R41.2 U7.15(PE1)
INPUT_SE: C38.2 R44.2 U7.16(PE2)
OUT_MON: C34.2 D16.A R30.2 R35.2 U7.23(PD3)
RL_H: R51.1 U7.32(PF0)
RL_IN: R61.1 U7.35(PD6)
RL_M: R57.1 U7.33(PD4)
RL_OUT: R60.1 U7.31(PB7)
RL_PASS: R58.1 U7.36(PD7)
SCL: R54.1 U7.8(PA7) U8.17(SCL) U9.6(SCL)
SDA: R55.1 U7.7(PA6) U8.16(SDA) U9.5(SDA)
USB_CS: U8.18(CS#)
USB_DETECT: R29.1 R34.2 U7.42(PC3)
USB_LED: R53.1 U7.5(PA4) U8.20(LED#)
VIN_MON: C28.2 C29.2 R26.1 R31.2 U7.22(PD2)
NetC26_2: C26.2 D15.K U6.8(VCC+)
NetC27_1: C27.1 D18.A U6.4(VCC-)
NetC35_+: C35.+ R36.2 R38.1 R39.1
NetC37_2: C37.2 R43.1 U7.2(~{RS}T_PA1)
NetC43_2: C43.2 U7.13(VLCD)
NetC49_1: C49.1 U8.10(XI) U10.1
NetC50_1: C50.1 U8.11(XO) U10.2
NetC51_2: R36.1 ; port DETECT_L
NetC63_1: R39.2 ; port DETECT_R
NetD17_A: D17.A U6.7(OUT2)
NetD17_K: D17.K R37.2 U6.3(IN1+)
NetD19_K: D19.K R45.1
NetD22_A: Q9.C ; port RELAY_H
NetD23_A: Q15.C ; port RELAY_IN
NetD24_A: Q12.C ; port RELAY_M
NetD29_A: Q13.C ; port RELAY_PASS
NetD32_A: Q14.C ; port RELAY_OUT
NetGAIN_SW_1: GAIN_SW.1 R46.2 R47.1
NetGAIN_SW_3: GAIN_SW.3 R49.1 R50.1
NetINPUT_SW_1: INPUT_SW.1 R40.2 R41.1
NetINPUT_SW_3: INPUT_SW.3 R42.1 R44.1
NetQ5_E: U7.34(PD5) ; port 24V_EN
NetQ9_B: Q9.B R51.2
NetQ10_B: Q10.B Q11.C R52.1
NetQ11_B: Q11.B R56.2
NetQ12_B: Q12.B R57.2
NetQ13_B: Q13.B R58.2
NetQ14_B: Q14.B R60.2
NetQ15_B: Q15.B R61.2
NetR30_1: R30.1 U6.1(OUT1) U6.2(IN1-)
NetR37_1: R37.1 R38.2 U6.6(IN2-)
NetR45_2: R45.2 U7.14(PE0)
NetR48_2: R48.2 U7.26(PB2) ; port 18V_EN
NetR59_2: R59.2 U8.19(ID0)

Not connected (* = marked no-connect by the designer): U7 1(PA0) 3(PA2) 4(PA3) 19(PE5) 24(PB0) 25(PB1) 27(PB3) 28(PB4) 29(PB5) 37(PC0) 38(PC1) 41(PC2) 43(PC4) 44(PC5) 45(PC6) 46(PC7) 47(PE6) 48(PE7); U8 1(SOUT)* 2(SCLK)* 3(NC)* 4(RDY)* 5(WP#)* 7(UD+) 8(UD-) 13(ID1)* 14(SIN)*

### Notes on the sheet
- 2.18V
- 1.64V
- 1.04V
- (near Q9) Marked Y1
- D+ from USB
- D- from USB
- (near Q12) Marked Y1
- (near Q13) Marked Y1
- (near Q10) Marked A1
- (near Q11) Marked Y1
- (near Q14) Marked Y1
- (near Q15) Marked Y1
- STM
- (in symbol TL072HIDR, part C) +; -

### Library data of the parts
C26-C34 C36 C38 C42-C44 C46-C50 = C_MLCC_0603: as C1 on sheet Amp; Category: Capacitor; Sub-Category: MLCC; Manufacturer: Generic; Notes: *
  C26-C34 C36 C38 C42-C44: Value: *
C35 = 860160378038: as C10 on sheet Power; Height - Seated (Max): 0.846inch; RoHS Compliant: Yes; Max Operating Temperature: 105°C; Sub-Category: Electrolytic; Mount: Through Hole; Min Operating Temperature: -55°C; Packaging: Tape and Reel; Category: Capacitor; Package Quantity: 300; Voltage Rating: 16V; Lead Pitch: 0.197inch; Case/Package: Radial; Manufacturer Part Number: 860160378038; Component Type: Standard_Passive_C
C37 C40 C41 = C_MLCC_0603: Generic MLCC 0603 Non Polarized Capacitor; Value: 100n; Category: Capacitor; Sub-Category: MLCC; Manufacturer: Generic; Notes: *
C39 C45 = C_MLCC_0805: as C3 on sheet Amp; Category: Capacitor; Sub-Category: MLCC; Manufacturer: Generic; Notes: *
  C39: Value: *
D15-D18 = 1N4148: as D1 on sheet Amp; Peak Reflow Temperature (Cel): 260°C; Max Operating Temperature: 150°C; Terminal Position: DUAL; Technology: SCHOTTKY; JESD-30 Code: R-PDSO-G2; Category: Diode; Surface Mount: Yes; RoHS Compliant: Yes; Manufacturer: Generic; Number of Pins: 2; Sub-Category: Signal; Terminal Form: Gull Wing; REACH SVHC: Yes; JESD-609 Code: e3; Package Shape: Rectangular; Package Style: SMALL OUTLINEMeter; Terminal Finish: Tin; Component Type: Standard_Diode; Value: 1N4148
D19 = LED_TH_3mm_RED: Generic Through Hole 3mm Red Led; Manufacturer: Generic; Category: Diode; Sub-Category: LED; Value: LED_TH_3mm_RED
GAIN_SW INPUT_SW = 1MS1T2B1M2QES: Mini Toggle Switch 1M Series SPDT ON-ON Short Lever PC Through-Hole; Manufacturer: Dailywell; Category: Switch; Sub-Category: Mechanical
Q9 Q11-Q15 = MMBT5551: NPN General-Purpose / Amplifier; pin to pad: B>1 C>3 E>2; Manufacturer: On Semi; Manufacturer Part Number: MMBT3904VL; Package Body Material: Plastic; JEDEC-95 Code: TO-236AB; Transistor Application: SWITCHING; Max Collector Current: 200mA; DC Current Gain-Min (hFE): 30; Turn-on Time-Max (ton): 70ns; Turn-off Time-Max (toff): 250ns; Transistor Element Material: SILICON; Number of Elements: 1; Transition Frequency-Nom (fT): 300MHz; Collector-emitter Voltage-Max: 40V; Package Shape: Rectangular; JESD-30 Code: R-PDSO-G3; Number of Pins: 3; REACH SVHC: Yes; Sub-Category: BJT; RoHS Compliant: Yes; Terminal Position: DUAL; Surface Mount: Yes; Terminal Form: Gull Wing; Package Style: SMALL OUTLINEMeter; Polarity/Channel Type: NPN; Category: Transistor; Component Type: Standard_Transistor
Q10 = MMBT5401: PNP Epitaxial Silicon Transistor; pin to pad: B>1 C>3 E>2; Manufacturer: MCC; Manufacturer Part Number: MMBT3904VL; Package Body Material: Plastic; JEDEC-95 Code: TO-236AB; Transistor Application: SWITCHING; Max Collector Current: 200mA; DC Current Gain-Min (hFE): 30; Turn-on Time-Max (ton): 70ns; Turn-off Time-Max (toff): 250ns; Number of Elements: 1; Polarity/Channel Type: NPN; Transition Frequency-Nom (fT): 300MHz; Collector-emitter Voltage-Max: 40V; Package Shape: Rectangular; JESD-30 Code: R-PDSO-G3; Number of Pins: 3; REACH SVHC: Yes; Sub-Category: BJT; RoHS Compliant: Yes; Transistor Element Material: SILICON; Terminal Position: DUAL; Surface Mount: Yes; Terminal Form: Gull Wing; Package Style: SMALL OUTLINEMeter; Category: Transistor; Component Type: Standard_Transistor; Value: ?
R26-R61 = R_0603: Generic 0603 Single Resistor; Manufacturer: Generic; Category: Resistor; Sub-Category: SMD; Notes: *
U6 = TL072HIDR: Operational Amplifiers - Op Amps Dual Low Noise Op Amp; Manufacturer: Texas Instruments; Category: IC; Sub-Category: OpAmp; Package: SOIC8; Value: TL072HIDR
U7 = STM8L052C6T6: Value Line, 8-bit ultra-low-power MCU, 32-KB Flash, 256-byte data / EEPROM, RTC, LCD, timers, USART, I2C, SPI, ADC; Manufacturer: ST Microelectronics; Category: IC; Sub-Category: CPU; Value: STM8L052C6T6
U8 = CH331A: USB 2.0 SSOP-20-208mil USB Converters ROHS; Manufacturer: WCH; Category: IC; Sub-Category: USB; Package: SSOP20; Value: CH331A
U9 = M24256D: 256-Kbit serial I²C bus EEPROM; Manufacturer: ST Microelectronics; Category: IC; Sub-Category: Memory; Package: SOIC8; Value: M24256D
U10 = Xtal: Generic Xtal

## Sheet Input.SchDoc
size A2; SheetNumber: 5; SheetTotal: 6
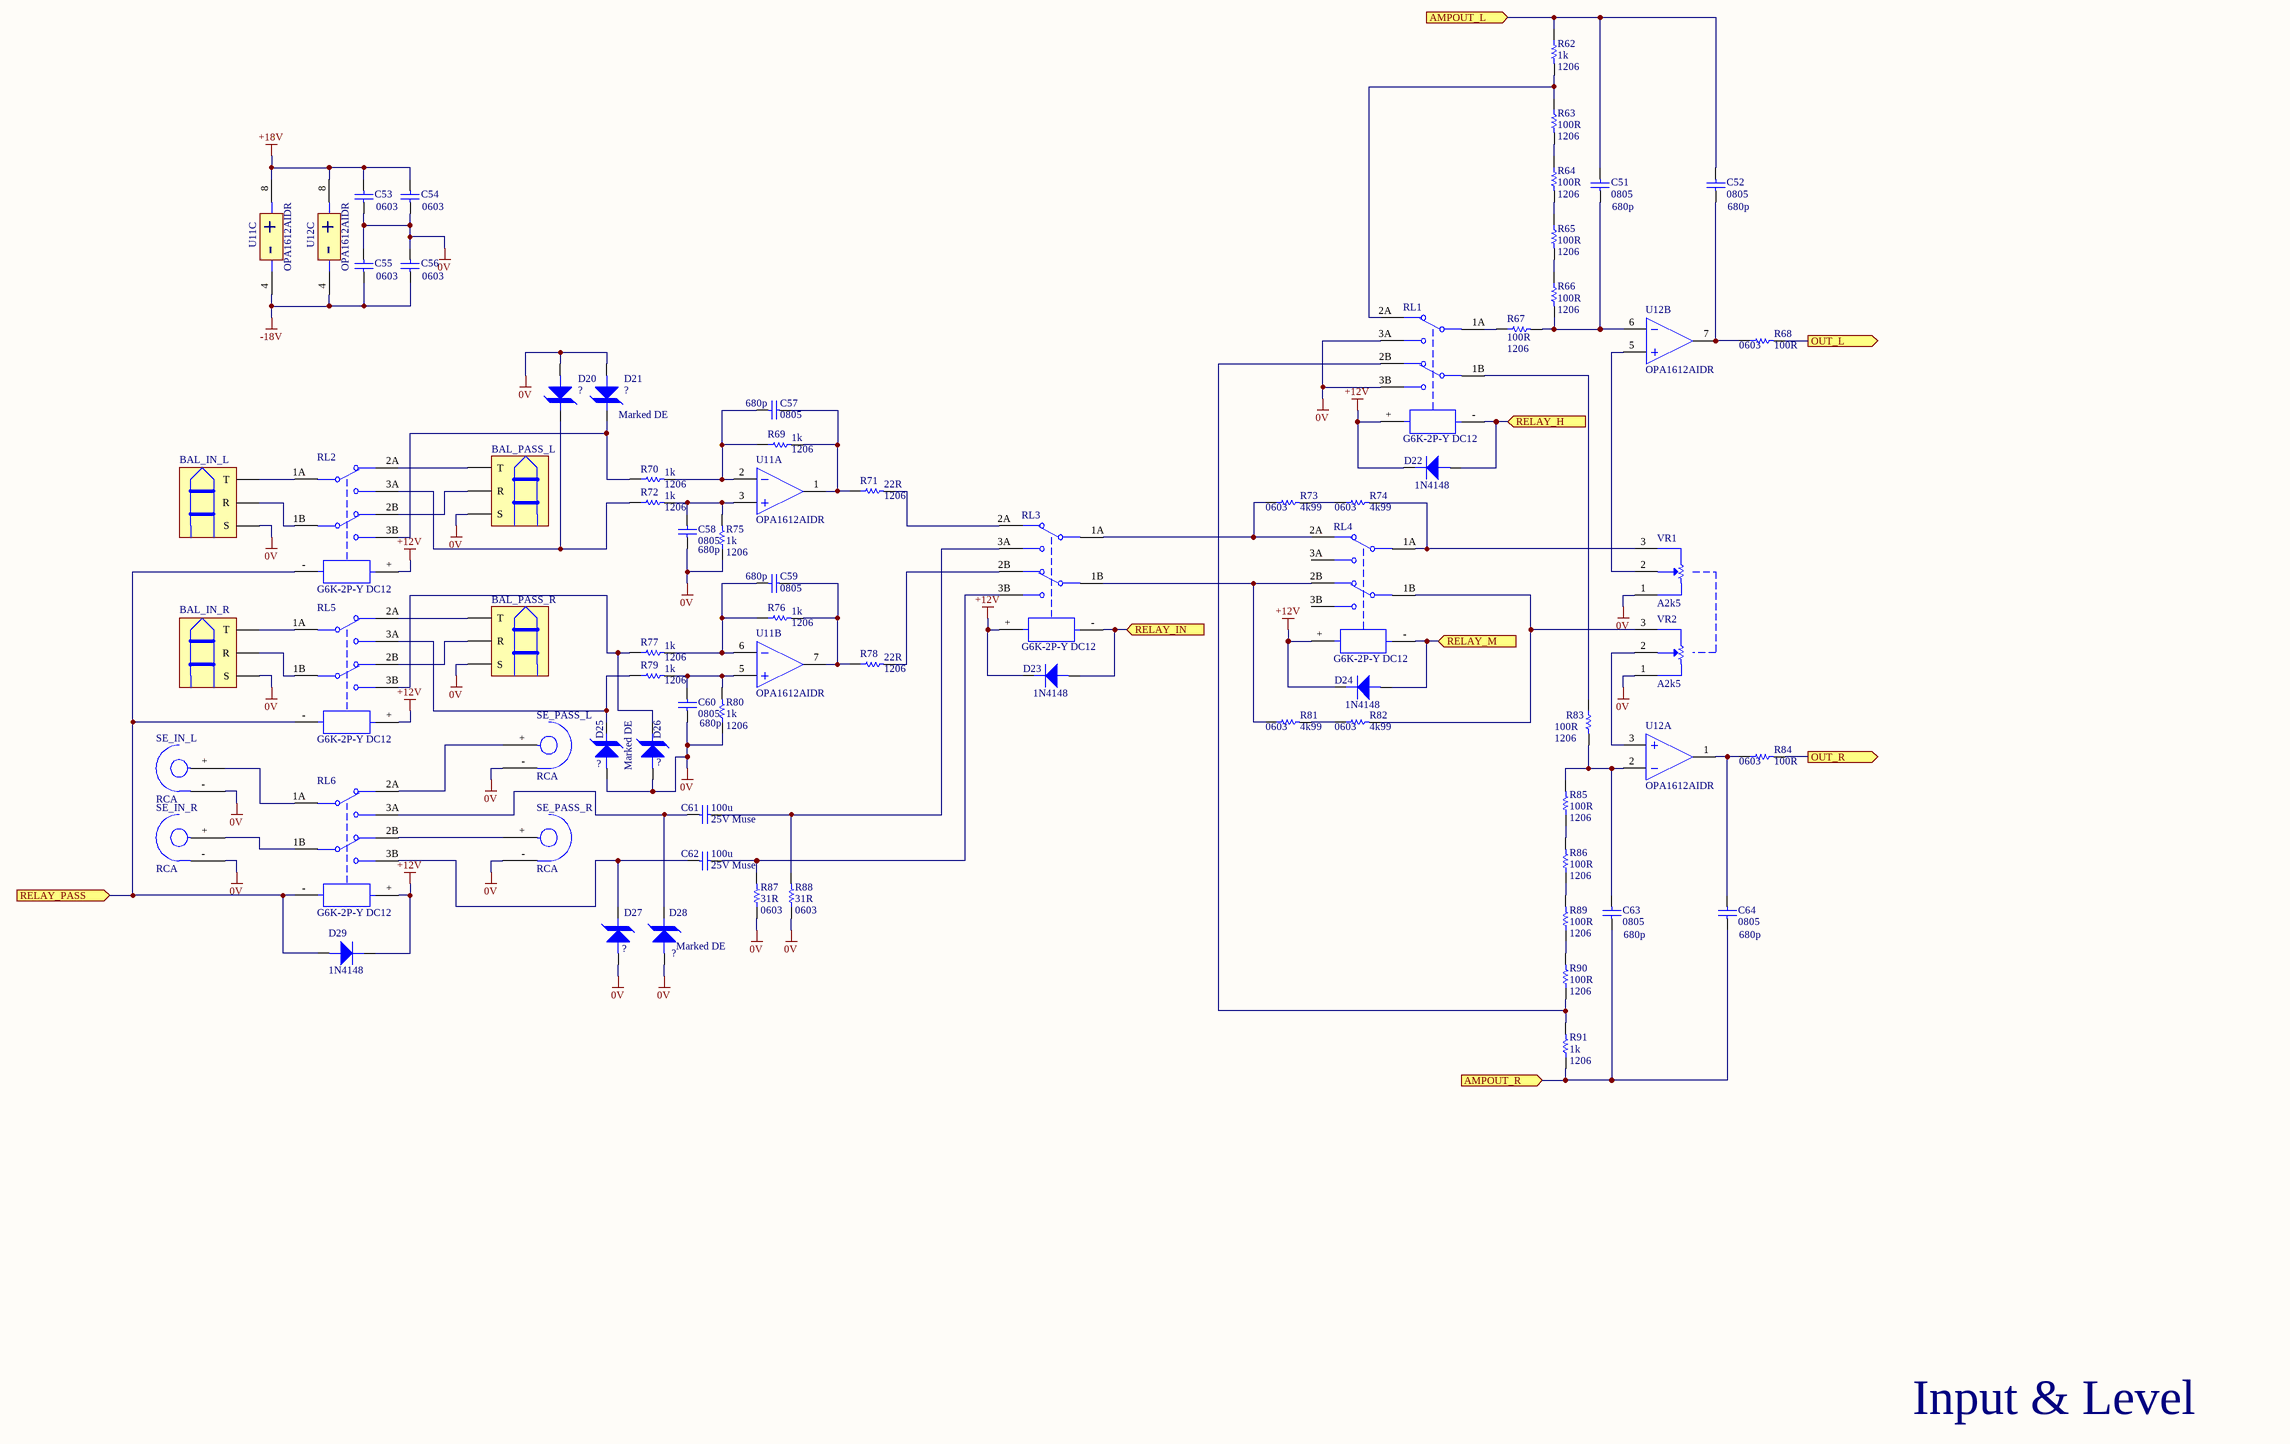
[diagram p4: Input.SchDoc]

### Parts
BAL_IN_L  SJ-63053A  [SJ-63053A]  (value not drawn)
BAL_IN_R  SJ-63053A  [SJ-63053A]  (value not drawn)
BAL_PASS_L  SJ-63053A  [SJ-63053A]  (value not drawn)
BAL_PASS_R  SJ-63053A  [SJ-63053A]  (value not drawn)
C51  value 680p  Package: 0805  [CAPC2012X14N]  (hidden comment: C_MLCC_0805)
C52  value 680p  Package: 0805  [CAPC2012X14N]  (hidden comment: C_MLCC_0805)
C53  Package: 0603  [CAPC1608X09N]  (hidden comment: C_MLCC_0603)
C54  Package: 0603  [CAPC1608X09N]  (hidden comment: C_MLCC_0603)
C55  Package: 0603  [CAPC1608X09N]  (hidden comment: C_MLCC_0603)
C56  Package: 0603  [CAPC1608X09N]  (hidden comment: C_MLCC_0603)
C57  value 680p  Package: 0805  [CAPC2012X14N]  (hidden comment: C_MLCC_0805)
C58  value 680p  Package: 0805  [CAPC2012X14N]  (hidden comment: C_MLCC_0805)
C59  value 680p  Package: 0805  [CAPC2012X14N]  (hidden comment: C_MLCC_0805)
C60  value 680p  Package: 0805  [CAPC2012X14N]  (hidden comment: C_MLCC_0805)
C61  value 100u  Notes: 25V Muse  [CAPC2012X14N]  (hidden comment: C_MLCC_0805)
C62  value 100u  Notes: 25V Muse  [CAPC2012X14N]  (hidden comment: C_MLCC_0805)
C63  value 680p  Package: 0805  [CAPC2012X14N]  (hidden comment: C_MLCC_0805)
C64  value 680p  Package: 0805  [CAPC2012X14N]  (hidden comment: C_MLCC_0805)
D20  TVS  [DIOM4336X24N]  (value not drawn)
D21  TVS  [DIOM4336X24N]  (value not drawn)
D22  1N4148
D23  1N4148
D24  1N4148
D25  TVS  [DIOM4336X24N]  (value not drawn)
D26  TVS  [DIOM4336X24N]  (value not drawn)
D27  TVS  [DIOM4336X24N]  (value not drawn)
D28  TVS  [DIOM4336X24N]  (value not drawn)
D29  1N4148
R62  value 1k  Package: 1206  [RESC3116X06N]  (hidden comment: R)
R63  value 100R  Package: 1206  [RESC3116X06N]  (hidden comment: R)
R64  value 100R  Package: 1206  [RESC3116X06N]  (hidden comment: R)
R65  value 100R  Package: 1206  [RESC3116X06N]  (hidden comment: R)
R66  value 100R  Package: 1206  [RESC3116X06N]  (hidden comment: R)
R67  value 100R  Package: 1206  [RESC3116X06N]  (hidden comment: R)
R68  value 100R  Package: 0603  [RESC1608X06N]  (hidden comment: R)
R69  value 1k  Package: 1206  [RESC3116X06N]  (hidden comment: R)
R70  value 1k  Package: 1206  [RESC3116X06N]  (hidden comment: R)
R71  value 22R  Package: 1206  [RESC3116X06N]  (hidden comment: R)
R72  value 1k  Package: 1206  [RESC3116X06N]  (hidden comment: R)
R73  value 4k99  Package: 0603  [RESC1608X06N]  (hidden comment: R)
R74  value 4k99  Package: 0603  [RESC1608X06N]  (hidden comment: R)
R75  value 1k  Package: 1206  [RESC3116X06N]  (hidden comment: R)
R76  value 1k  Package: 1206  [RESC3116X06N]  (hidden comment: R)
R77  value 1k  Package: 1206  [RESC3116X06N]  (hidden comment: R)
R78  value 22R  Package: 1206  [RESC3116X06N]  (hidden comment: R)
R79  value 1k  Package: 1206  [RESC3116X06N]  (hidden comment: R)
R80  value 1k  Package: 1206  [RESC3116X06N]  (hidden comment: R)
R81  value 4k99  Package: 0603  [RESC1608X06N]  (hidden comment: R)
R82  value 4k99  Package: 0603  [RESC1608X06N]  (hidden comment: R)
R83  value 100R  Package: 1206  [RESC3116X06N]  (hidden comment: R)
R84  value 100R  Package: 0603  [RESC1608X06N]  (hidden comment: R)
R85  value 100R  Package: 1206  [RESC3116X06N]  (hidden comment: R)
R86  value 100R  Package: 1206  [RESC3116X06N]  (hidden comment: R)
R87  value 31R  Package: 0603  [RESC1608X06N]  (hidden comment: R)
R88  value 31R  Package: 0603  [RESC1608X06N]  (hidden comment: R)
R89  value 100R  Package: 1206  [RESC3116X06N]  (hidden comment: R)
R90  value 100R  Package: 1206  [RESC3116X06N]  (hidden comment: R)
R91  value 1k  Package: 1206  [RESC3116X06N]  (hidden comment: R)
RL1  G6K-2P-Y DC12  [G6K-2P-Y]
RL2  G6K-2P-Y DC12  [G6K-2P-Y]
RL3  G6K-2P-Y DC12  [G6K-2P-Y]
RL4  G6K-2P-Y DC12  [G6K-2P-Y]
RL5  G6K-2P-Y DC12  [G6K-2P-Y]
RL6  G6K-2P-Y DC12  [G6K-2P-Y]
SE_IN_L  RCA
SE_IN_R  RCA
SE_PASS_L  RCA
SE_PASS_R  RCA
U11  OPA1612AIDR  [SOIC127P600X175-8L]  (parts A,B,C of 3)
U12  OPA1612AIDR  [SOIC127P600X175-8L]  (parts A,B,C of 3)
VR1  value A2k5  (hidden comment: Pot)
VR2  value A2k5  (hidden comment: Pot)

### Ports
AMPOUT_L (in, see Top[2C]), AMPOUT_R (in, see Top[2C]), OUT_L (out, see Top[2B]), OUT_R (out, see Top[2B]), RELAY_H (in, see Top[2C], STM[7C]), RELAY_IN (in, see Top[2C], STM[8D]), RELAY_M (in, see Top[2C], STM[7C]), RELAY_PASS (in, see Top[2C], STM[8C])

### Nets
0V: BAL_IN_L.S BAL_IN_R.S BAL_PASS_L.S BAL_PASS_R.S C53.1 C54.1 C55.2 C56.2 C58.1 C60.1 D20.A D21.A D25.A D26.A D27.A D28.A R75.1 R80.1 R87.1 R88.1 RL1.3A RL1.3B SE_IN_L.- SE_IN_R.- SE_PASS_L.- SE_PASS_R.- VR1.1 VR2.1
+12V: D22.K D23.K D24.K D29.K RL1.+ RL2.+ RL3.+ RL4.+ RL5.+ RL6.+
+18V: C53.2 C54.2 U11.8(VCC+) U12.8(VCC+)
-18V: C55.1 C56.1 U11.4(VCC-) U12.4(VCC-)
NetBAL_IN_L_R: BAL_IN_L.R RL2.1B
NetBAL_IN_L_T: BAL_IN_L.T RL2.1A
NetBAL_IN_R_R: BAL_IN_R.R RL5.1B
NetBAL_IN_R_T: BAL_IN_R.T RL5.1A
NetBAL_PASS_L_R: BAL_PASS_L.R RL2.2B
NetBAL_PASS_L_T: BAL_PASS_L.T RL2.2A
NetBAL_PASS_R_R: BAL_PASS_R.R RL5.2B
NetBAL_PASS_R_T: BAL_PASS_R.T RL5.2A
NetC51_1: C51.1 R66.2 R67.2 U12.6(IN2-)
NetC51_2: C51.2 C52.2 R62.1 ; port AMPOUT_L
NetC52_1: C52.1 R68.1 U12.7(OUT2)
NetC57_1: C57.1 R69.1 R70.2 U11.2(IN1-)
NetC57_2: C57.2 R69.2 R71.1 U11.1(OUT1)
NetC58_2: C58.2 R72.2 R75.2 U11.3(IN1+)
NetC59_1: C59.1 R76.1 R77.2 U11.6(IN2-)
NetC59_2: C59.2 R76.2 R78.1 U11.7(OUT2)
NetC60_2: C60.2 R79.2 R80.2 U11.5(IN2+)
NetC61_1: C61.1 D28.K RL6.3A
NetC61_2: C61.2 R88.2 RL3.3A
NetC62_1: C62.1 D27.K RL6.3B
NetC62_2: C62.2 R87.2 RL3.3B
NetC63_1: C63.1 C64.1 R91.1 ; port AMPOUT_R
NetC63_2: C63.2 R83.2 R85.2 U12.2(IN1-)
NetC64_2: C64.2 R84.1 U12.1(OUT1)
NetD20_K: D20.K R72.1 RL2.3A
NetD21_K: D21.K R70.1 RL2.3B
NetD22_A: D22.A RL1.- ; port RELAY_H
NetD23_A: D23.A RL3.- ; port RELAY_IN
NetD24_A: D24.A RL4.- ; port RELAY_M
NetD25_K: D25.K R79.1 RL5.3A
NetD26_K: D26.K R77.1 RL5.3B
NetD29_A: D29.A RL2.- RL5.- RL6.- ; port RELAY_PASS
NetR62_2: R62.2 R63.1 RL1.2A
NetR63_2: R63.2 R64.1
NetR64_2: R64.2 R65.1
NetR65_2: R65.2 R66.1
NetR67_1: R67.1 RL1.1A
NetR68_2: R68.2 ; port OUT_L
NetR71_2: R71.2 RL3.2A
NetR73_1: R73.1 RL3.1A RL4.2A
NetR73_2: R73.2 R74.1
NetR74_2: R74.2 RL4.1A VR1.3
NetR78_2: R78.2 RL3.2B
NetR81_1: R81.1 RL3.1B RL4.2B
NetR81_2: R81.2 R82.1
NetR82_2: R82.2 RL4.1B VR2.3
NetR83_1: R83.1 RL1.1B
NetR84_2: R84.2 ; port OUT_R
NetR85_1: R85.1 R86.2
NetR86_1: R86.1 R89.2
NetR89_1: R89.1 R90.2
NetR90_1: R90.1 R91.2 RL1.2B
NetRL6_1A: RL6.1A SE_IN_L.+
NetRL6_1B: RL6.1B SE_IN_R.+
NetRL6_2A: RL6.2A SE_PASS_L.+
NetRL6_2B: RL6.2B SE_PASS_R.+
NetU12_3: U12.3(IN1+) VR2.2
NetU12_5: U12.5(IN2+) VR1.2

Not connected (* = marked no-connect by the designer): RL4 3A 3B

### Notes on the sheet
- (near D21) Marked DE
- Marked DE
- (near D28) Marked DE
- Input & Level
- (in symbol OPA1612AIDR, part C) +; -

### Library data of the parts
BAL_IN_L BAL_IN_R BAL_PASS_L BAL_PASS_R = SJ-63053A: 6.35 mm, Stereo, Right Angle, Through Hole Mount, 3 Conductors, 0 Internal Switches, Audio Jack Connector; Manufacturer: Same Sky; Category: Connector; Sub-Category: Jack; Value: SJ-63053A
C51 C52 C57-C64 = C_MLCC_0805: as C3 on sheet Amp; Category: Capacitor; Sub-Category: MLCC; Manufacturer: Generic
  C51 C52 C57-C60 C63 C64: Notes: *
  C61 C62: Package: 0805
C53-C56 = C_MLCC_0603: as C1 on sheet Amp; Category: Capacitor; Sub-Category: MLCC; Manufacturer: Generic; Notes: *; Value: *
D20 D21 D25-D28 = TVS: as D12 on sheet Power; Min Operating Temperature: -55°C; REACH SVHC: No SVHC; Terminal Finish: Tin; Moisture Sensitivity Level: 1; Number of Pins: 2; JESD-30 Code: R-PDSO-C2; Technology: AVALANCHE; Terminal Position: DUAL; Max Operating Temperature: 150°C; Package Style: SMALL OUTLINEMeter; Package Shape: Rectangular; Terminal Form: C BEND; RoHS Compliant: Yes; Surface Mount: Yes; JESD-609 Code: e3; Sub-Category: TVS; Category: Diode; Component Type: Standard_Diode; Value: ?
D22-D24 D29 = 1N4148: as D1 on sheet Amp; Peak Reflow Temperature (Cel): 260°C; Max Operating Temperature: 150°C; Terminal Position: DUAL; Technology: SCHOTTKY; JESD-30 Code: R-PDSO-G2; Category: Diode; Surface Mount: Yes; RoHS Compliant: Yes; Manufacturer: Generic; Number of Pins: 2; Sub-Category: Signal; Terminal Form: Gull Wing; REACH SVHC: Yes; JESD-609 Code: e3; Package Shape: Rectangular; Package Style: SMALL OUTLINEMeter; Terminal Finish: Tin; Component Type: Standard_Diode; Value: 1N4148
R62-R67 R69-R72 R75-R80 R83 R85 R86 R89-R91 = R_1206: Generic 1206 Single Resistor; Manufacturer: Generic; Category: Resistor; Sub-Category: SMD; Notes: *
R68 R73 R74 R81 R82 R84 R87 R88 = R_0603: Generic 0603 Single Resistor; Manufacturer: Generic; Category: Resistor; Sub-Category: SMD; Notes: *
RL1-RL6 = G6K-2P-Y DC12: Low Signal Relays - PCB Gullwing NoLatch 3.2 DPDT 12VDC 100mW T/R; Manufacturer: Omron; Category: Switch; Sub-Category: Relay; Value: G6K-2P-Y DC12
SE_IN_L SE_IN_R SE_PASS_L SE_PASS_R = RCA: Generic RCA Connector; Manufacturer: Generic; Category: Connector; Sub-Category: Audio; Value: RCA
U11 U12 = OPA1612AIDR: High-Performance, Bipolar-Input Audio Operational Amplifiers; Manufacturer: Texas Instruments; Category: IC; Sub-Category: OpAmp; Package: SOIC8; Value: OPA1612AIDR
VR1 VR2 = Pot: Generic Pot; Manufacturer: Generic; Category: Resistor; Sub-Category: Pot

## Sheet Output.SchDoc
size A4; SheetNumber: 6; SheetTotal: 6
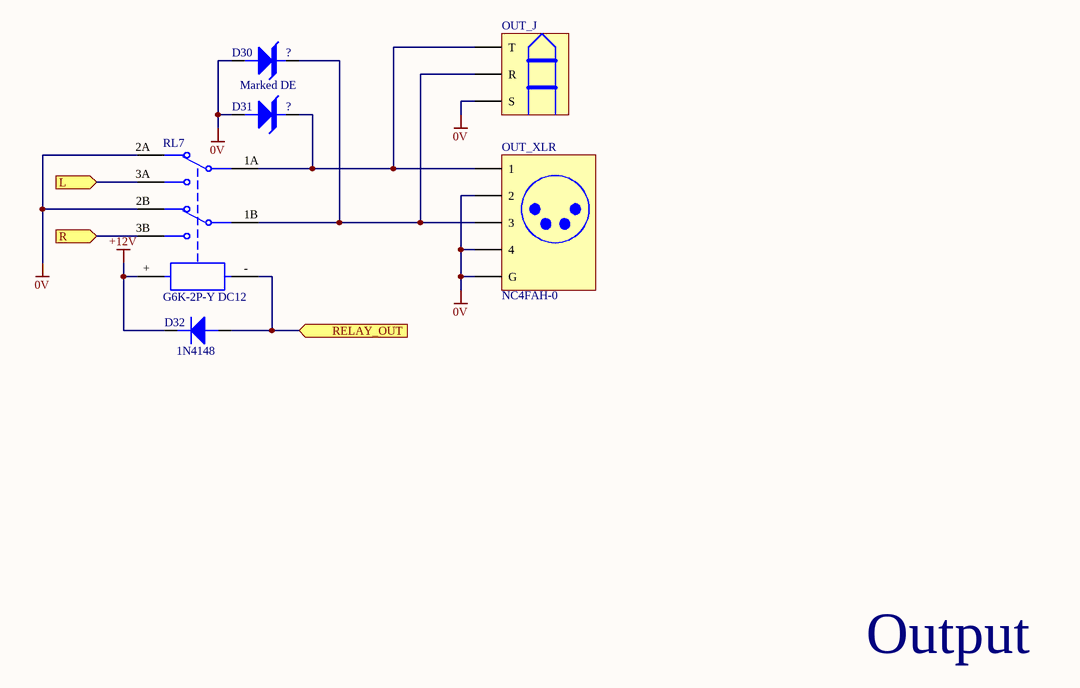
[diagram p5: Output.SchDoc]

### Parts
D30  TVS  [DIOM4336X24N]  (value not drawn)
D31  TVS  [DIOM4336X24N]  (value not drawn)
D32  1N4148
OUT_J  SJ-63053A  [SJ-63053A]  (value not drawn)
OUT_XLR  NC4FAH-0
RL7  G6K-2P-Y DC12  [G6K-2P-Y]

### Ports
L (in, see Top[3B]), R (in, see Top[3B]), RELAY_OUT (in, see Top[3B], STM[7D])

### Nets
0V: D30.A D31.A OUT_J.S OUT_XLR.2 OUT_XLR.4 OUT_XLR.G RL7.2A RL7.2B
+12V: D32.K RL7.+
NetC51_2: RL7.3A ; port L
NetC63_1: RL7.3B ; port R
NetD30_K: D30.K OUT_J.R OUT_XLR.3 RL7.1B
NetD31_K: D31.K OUT_J.T OUT_XLR.1 RL7.1A
NetD32_A: D32.A RL7.- ; port RELAY_OUT

### Notes on the sheet
- Marked DE
- Output

### Library data of the parts
D30 D31 = TVS: as D12 on sheet Power; Min Operating Temperature: -55°C; REACH SVHC: No SVHC; Terminal Finish: Tin; Moisture Sensitivity Level: 1; Number of Pins: 2; JESD-30 Code: R-PDSO-C2; Technology: AVALANCHE; Terminal Position: DUAL; Max Operating Temperature: 150°C; Package Style: SMALL OUTLINEMeter; Package Shape: Rectangular; Terminal Form: C BEND; RoHS Compliant: Yes; Surface Mount: Yes; JESD-609 Code: e3; Sub-Category: TVS; Category: Diode; Component Type: Standard_Diode; Value: ?
D32 = 1N4148: as D1 on sheet Amp; Peak Reflow Temperature (Cel): 260°C; Max Operating Temperature: 150°C; Terminal Position: DUAL; Technology: SCHOTTKY; JESD-30 Code: R-PDSO-G2; Category: Diode; Surface Mount: Yes; RoHS Compliant: Yes; Manufacturer: Generic; Number of Pins: 2; Sub-Category: Signal; Terminal Form: Gull Wing; REACH SVHC: Yes; JESD-609 Code: e3; Package Shape: Rectangular; Package Style: SMALL OUTLINEMeter; Terminal Finish: Tin; Component Type: Standard_Diode; Value: 1N4148
OUT_J = SJ-63053A: as BAL_IN_L on sheet Input; Category: Connector; Sub-Category: Jack; Value: SJ-63053A
OUT_XLR = NC4FAH-0: 4 pole XLR female receptacle with 1/4" stereo jack, horizontal PCB mount; Manufacturer: Neutrik; Category: Connector; Sub-Category: XLR; Value: NC4FAH-0
RL7 = G6K-2P-Y DC12: as RL1 on sheet Input; Category: Switch; Sub-Category: Relay; Value: G6K-2P-Y DC12

## Nets that join several sheets
0V: L (16 pins), R (16 pins), Power (28 pins), STM (46 pins), Input (28 pins), Output (8 pins)
+3V3: Power (C17.2 U4.OUT), STM (20 pins)
+12V: Power (C11.+ D14.A L1.2 R16.2), STM (R28.2), Input (10 pins), Output (D32.K RL7.+)
+18V: Power (C18.2 C19.2 R22.2 U3.1), STM (D15.A R27.2), Input (C53.2 C54.2 U11.8 U12.8)
+24V: L (Q1_L.E R1_L.2 R3_L.2), R (Q1_R.E R1_R.2 R3_R.2), Power (Q7.C)
+VIN: Power (9 pins), STM (R26.2)
-18V: Power (C22.2 C23.2 R24.2 U5.1), STM (D18.K R32.1), Input (C55.1 C56.1 U11.4 U12.4)
-24V: L (Q4_L.E R11_L.2 R13_L.2), R (Q4_R.E R11_R.2 R13_R.2), Power (Q6.C)
-VIN: Power (6 pins), STM (R31.1)
VBUS: Power (D12.K D13.A), STM (R29.2)
NetC51_2: L (5 pins), STM (R36.1), Input (C51.2 C52.2 R62.1), Output (RL7.3A)
NetC63_1: R (5 pins), STM (R39.2), Input (C63.1 C64.1 R91.1), Output (RL7.3B)
NetD22_A: STM (Q9.C), Input (D22.A RL1.-)
NetD23_A: STM (Q15.C), Input (D23.A RL3.-)
NetD24_A: STM (Q12.C), Input (D24.A RL4.-)
NetD29_A: STM (Q13.C), Input (D29.A RL2.- RL5.- RL6.-)
NetD32_A: STM (Q14.C), Output (D32.A RL7.-)
NetQ5_E: Power (Q5.E R19.1), STM (U7.34)
NetR48_2: Power (U3.5 U5.5), STM (R48.2 U7.26)
NetR68_2: L (U1_L.4 U1_L.17), Input (R68.2)
NetR84_2: R (U1_R.4 U1_R.17), Input (R84.2)